# Altium project slave-18-ltc6813-1.PrjPcb (part 1 of 2)
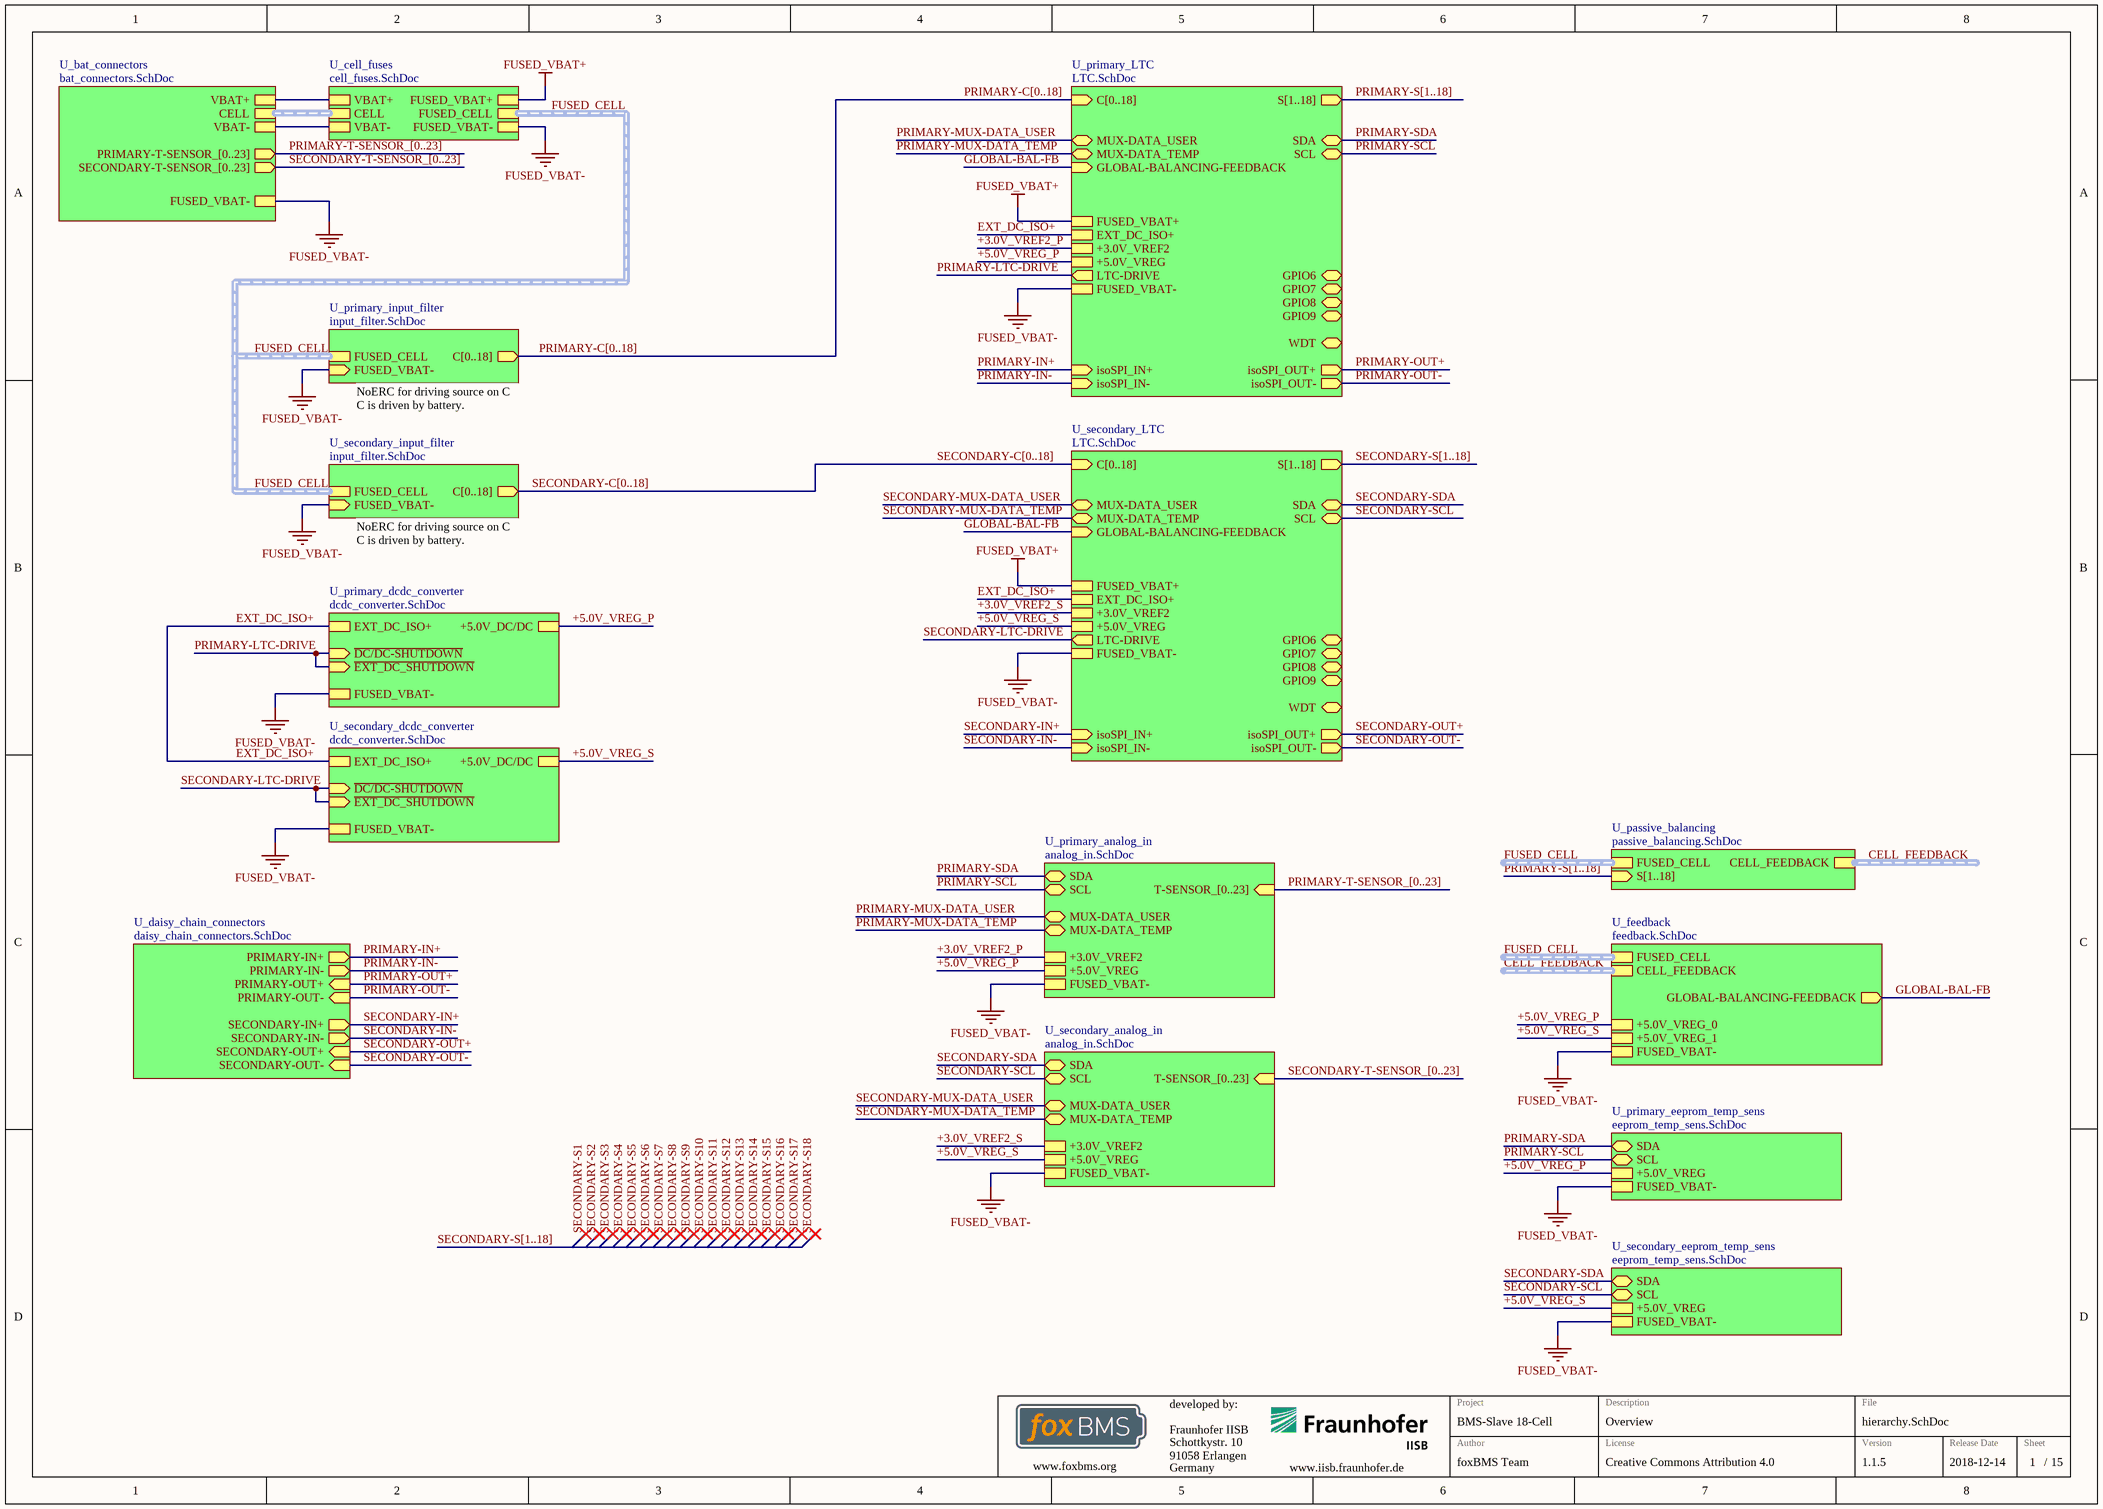
[diagram p0: hierarchy.SchDoc]
GlobalDate: 2018-12-14; GlobalLicense: Creative Commons Attribution 4.0; GlobalProject: BMS-Slave 18-Cell; GlobalVersion: 1.1.5
10 sheets, 519 parts. Net scope: strictly hierarchical (ports join the sheet entries above them; power ports are local).
Board files: slave.PcbDoc, AMS_Slave.PcbDoc
Sheets:
  hierarchy.SchDoc
    U_cell_fuses = cell_fuses.SchDoc
    U_primary_input_filter = input_filter.SchDoc
    U_secondary_input_filter = input_filter.SchDoc
    U_feedback = feedback.SchDoc
    U_primary_LTC = LTC.SchDoc
    U_secondary_eeprom_temp_sens = eeprom_temp_sens.SchDoc
    U_secondary_analog_in = analog_in.SchDoc
    U_daisy_chain_connectors = daisy_chain_connectors.SchDoc
    U_bat_connectors = bat_connectors.SchDoc
    U_primary_dcdc_converter = dcdc_converter.SchDoc
    U_secondary_dcdc_converter = dcdc_converter.SchDoc
    U_secondary_LTC = LTC.SchDoc
    U_primary_eeprom_temp_sens = eeprom_temp_sens.SchDoc
    U_primary_analog_in = analog_in.SchDoc

## Sheet hierarchy.SchDoc
size A3; DocumentNumber: 1; SheetNumber: 1; SheetTotal: 15; SheetDescription: Overview

### Sub-sheets
U_bat_connectors = bat_connectors.SchDoc: CELL (harness CELL_VOLTAGES), PRIMARY-T-SENSOR_[0..23] (out), SECONDARY-T-SENSOR_[0..23] (out), VBAT+, VBAT-, FUSED_VBAT-
U_cell_fuses = cell_fuses.SchDoc: FUSED_CELL (harness CELL_VOLTAGES), CELL (harness CELL_VOLTAGES), VBAT+, VBAT-, FUSED_VBAT+, FUSED_VBAT-
U_daisy_chain_connectors = daisy_chain_connectors.SchDoc: SECONDARY-IN+ (out), SECONDARY-IN- (out), SECONDARY-OUT+ (in), SECONDARY-OUT- (in), PRIMARY-IN+ (out), PRIMARY-IN- (out), PRIMARY-OUT- (in), PRIMARY-OUT+ (in)
U_feedback = feedback.SchDoc: GLOBAL-BALANCING-FEEDBACK (out), CELL_FEEDBACK (harness CELL_FEEDBACK), FUSED_CELL (harness CELL_VOLTAGES), +5.0V_VREG_1, +5.0V_VREG_0, FUSED_VBAT-
U_passive_balancing = passive_balancing.SchDoc (file not in this document): FUSED_CELL (harness CELL_VOLTAGES), S[1..18] (in), CELL_FEEDBACK (harness CELL_FEEDBACK)
U_primary_analog_in = analog_in.SchDoc: MUX-DATA_TEMP (bidir), MUX-DATA_USER (bidir), T-SENSOR_[0..23] (in), SCL (bidir), SDA (bidir), +5.0V_VREG, FUSED_VBAT-, +3.0V_VREF2
U_primary_dcdc_converter = dcdc_converter.SchDoc: +5.0V_DC/DC, FUSED_VBAT-, ~{DC/DC-SHUTDOWN} (in), EXT_DC_ISO+, ~{EXT_DC_SHUTDOWN} (in)
U_primary_eeprom_temp_sens = eeprom_temp_sens.SchDoc: SDA (bidir), SCL (bidir), FUSED_VBAT-, +5.0V_VREG
U_primary_input_filter = input_filter.SchDoc: FUSED_CELL (harness CELL_VOLTAGES), C[0..18] (out), FUSED_VBAT- (in)
U_primary_LTC = LTC.SchDoc: isoSPI_IN- (in), isoSPI_IN+ (in), isoSPI_OUT- (out), isoSPI_OUT+ (out), MUX-DATA_USER (bidir), SCL (bidir), MUX-DATA_TEMP (bidir), GLOBAL-BALANCING-FEEDBACK (in), SDA (bidir), EXT_DC_ISO+, C[0..18] (in), S[1..18] (out), WDT (bidir), GPIO8 (bidir), GPIO7 (bidir), GPIO9 (bidir), GPIO6 (bidir), FUSED_VBAT+, FUSED_VBAT-, +5.0V_VREG, +3.0V_VREF2, LTC-DRIVE (out)
U_secondary_analog_in = analog_in.SchDoc: MUX-DATA_TEMP (bidir), MUX-DATA_USER (bidir), T-SENSOR_[0..23] (in), SCL (bidir), SDA (bidir), +5.0V_VREG, FUSED_VBAT-, +3.0V_VREF2
U_secondary_dcdc_converter = dcdc_converter.SchDoc: +5.0V_DC/DC, FUSED_VBAT-, ~{DC/DC-SHUTDOWN} (in), EXT_DC_ISO+, ~{EXT_DC_SHUTDOWN} (in)
U_secondary_eeprom_temp_sens = eeprom_temp_sens.SchDoc: SDA (bidir), SCL (bidir), FUSED_VBAT-, +5.0V_VREG
U_secondary_input_filter = input_filter.SchDoc: FUSED_CELL (harness CELL_VOLTAGES), C[0..18] (out), FUSED_VBAT- (in)
U_secondary_LTC = LTC.SchDoc: isoSPI_IN- (in), isoSPI_IN+ (in), isoSPI_OUT- (out), isoSPI_OUT+ (out), MUX-DATA_USER (bidir), SCL (bidir), MUX-DATA_TEMP (bidir), GLOBAL-BALANCING-FEEDBACK (in), SDA (bidir), EXT_DC_ISO+, C[0..18] (in), S[1..18] (out), WDT (bidir), GPIO8 (bidir), GPIO7 (bidir), GPIO9 (bidir), GPIO6 (bidir), FUSED_VBAT+, FUSED_VBAT-, +5.0V_VREG, +3.0V_VREF2, LTC-DRIVE (out)

### Nets
+3.0V_VREF2_P: sheet U_primary_LTC/+3.0V_VREF2, sheet U_primary_analog_in/+3.0V_VREF2  [project net +3.0V_VREF2]
+3.0V_VREF2_S: sheet U_secondary_analog_in/+3.0V_VREF2, sheet U_secondary_LTC/+3.0V_VREF2  [project net +3.0V_VREF2]
+5.0V_VREG_P: sheet U_feedback/+5.0V_VREG_0, sheet U_primary_LTC/+5.0V_VREG, sheet U_primary_dcdc_converter/+5.0V_DC/DC, sheet U_primary_eeprom_temp_sens/+5.0V_VREG, sheet U_primary_analog_in/+5.0V_VREG  [project net +5.0V_VREG]
+5.0V_VREG_S: sheet U_feedback/+5.0V_VREG_1, sheet U_secondary_eeprom_temp_sens/+5.0V_VREG, sheet U_secondary_analog_in/+5.0V_VREG, sheet U_secondary_dcdc_converter/+5.0V_DC/DC, sheet U_secondary_LTC/+5.0V_VREG  [project net +5.0V_VREG]
FUSED_VBAT+: sheet U_cell_fuses/FUSED_VBAT+, sheet U_primary_LTC/FUSED_VBAT+, sheet U_secondary_LTC/FUSED_VBAT+
FUSED_VBAT-: sheet U_cell_fuses/FUSED_VBAT-, sheet U_primary_input_filter/FUSED_VBAT-, sheet U_secondary_input_filter/FUSED_VBAT-, sheet U_feedback/FUSED_VBAT-, sheet U_primary_LTC/FUSED_VBAT-, sheet U_secondary_eeprom_temp_sens/FUSED_VBAT-, sheet U_secondary_analog_in/FUSED_VBAT-, sheet U_bat_connectors/FUSED_VBAT-, sheet U_primary_dcdc_converter/FUSED_VBAT-, sheet U_secondary_dcdc_converter/FUSED_VBAT-, sheet U_secondary_LTC/FUSED_VBAT-, sheet U_primary_eeprom_temp_sens/FUSED_VBAT-, sheet U_primary_analog_in/FUSED_VBAT-
VBAT+: sheet U_cell_fuses/VBAT+, sheet U_bat_connectors/VBAT+
VBAT-: sheet U_cell_fuses/VBAT-, sheet U_bat_connectors/VBAT-
EXT_DC_ISO+: sheet U_primary_LTC/EXT_DC_ISO+, sheet U_primary_dcdc_converter/EXT_DC_ISO+, sheet U_secondary_dcdc_converter/EXT_DC_ISO+, sheet U_secondary_LTC/EXT_DC_ISO+
GLOBAL-BAL-FB: sheet U_feedback/GLOBAL-BALANCING-FEEDBACK, sheet U_primary_LTC/GLOBAL-BALANCING-FEEDBACK, sheet U_secondary_LTC/GLOBAL-BALANCING-FEEDBACK
PRIMARY-IN+: sheet U_primary_LTC/isoSPI_IN+, sheet U_daisy_chain_connectors/PRIMARY-IN+
PRIMARY-IN-: sheet U_primary_LTC/isoSPI_IN-, sheet U_daisy_chain_connectors/PRIMARY-IN-
PRIMARY-LTC-DRIVE: sheet U_primary_LTC/LTC-DRIVE, sheet U_primary_dcdc_converter/~{DC/DC-SHUTDOWN}, sheet U_primary_dcdc_converter/~{EXT_DC_SHUTDOWN}
PRIMARY-MUX-DATA_TEMP: sheet U_primary_LTC/MUX-DATA_TEMP, sheet U_primary_analog_in/MUX-DATA_TEMP
PRIMARY-MUX-DATA_USER: sheet U_primary_LTC/MUX-DATA_USER, sheet U_primary_analog_in/MUX-DATA_USER
PRIMARY-OUT+: sheet U_primary_LTC/isoSPI_OUT+, sheet U_daisy_chain_connectors/PRIMARY-OUT+
PRIMARY-OUT-: sheet U_primary_LTC/isoSPI_OUT-, sheet U_daisy_chain_connectors/PRIMARY-OUT-
PRIMARY-SCL: sheet U_primary_LTC/SCL, sheet U_primary_LTC/SDA, sheet U_primary_eeprom_temp_sens/SDA, sheet U_primary_eeprom_temp_sens/SCL, sheet U_primary_analog_in/SCL, sheet U_primary_analog_in/SDA  [also labelled PRIMARY-SDA]
SECONDARY-IN+: sheet U_daisy_chain_connectors/SECONDARY-IN+, sheet U_secondary_LTC/isoSPI_IN+
SECONDARY-IN-: sheet U_daisy_chain_connectors/SECONDARY-IN-, sheet U_secondary_LTC/isoSPI_IN-
SECONDARY-LTC-DRIVE: sheet U_secondary_dcdc_converter/~{DC/DC-SHUTDOWN}, sheet U_secondary_dcdc_converter/~{EXT_DC_SHUTDOWN}, sheet U_secondary_LTC/LTC-DRIVE
SECONDARY-MUX-DATA_TEMP: sheet U_secondary_analog_in/MUX-DATA_TEMP, sheet U_secondary_LTC/MUX-DATA_TEMP
SECONDARY-MUX-DATA_USER: sheet U_secondary_analog_in/MUX-DATA_USER, sheet U_secondary_LTC/MUX-DATA_USER
SECONDARY-OUT+: sheet U_daisy_chain_connectors/SECONDARY-OUT+, sheet U_secondary_LTC/isoSPI_OUT+
SECONDARY-OUT-: sheet U_daisy_chain_connectors/SECONDARY-OUT-, sheet U_secondary_LTC/isoSPI_OUT-
SECONDARY-SCL: sheet U_secondary_eeprom_temp_sens/SDA, sheet U_secondary_eeprom_temp_sens/SCL, sheet U_secondary_analog_in/SCL, sheet U_secondary_analog_in/SDA, sheet U_secondary_LTC/SCL, sheet U_secondary_LTC/SDA  [also labelled SECONDARY-SDA]

### Buses and harness runs
bus PRIMARY-C[0..18] = sheet U_primary_input_filter/C[0..18] = sheet U_primary_LTC/C[0..18]
bus PRIMARY-S[1..18] = sheet U_passive_balancing/S[1..18]
bus PRIMARY-S[1..18] = sheet U_primary_LTC/S[1..18]
bus PRIMARY-T-SENSOR_[0..23] = sheet U_bat_connectors/PRIMARY-T-SENSOR_[0..23]
bus PRIMARY-T-SENSOR_[0..23] = sheet U_primary_analog_in/T-SENSOR_[0..23]
bus SECONDARY-C[0..18] = sheet U_secondary_input_filter/C[0..18] = sheet U_secondary_LTC/C[0..18]
bus SECONDARY-S[1..18]
bus SECONDARY-S[1..18] = sheet U_secondary_LTC/S[1..18]
bus SECONDARY-T-SENSOR_[0..23] = sheet U_bat_connectors/SECONDARY-T-SENSOR_[0..23]
bus SECONDARY-T-SENSOR_[0..23] = sheet U_secondary_analog_in/T-SENSOR_[0..23]
harness CELL_FEEDBACK = sheet U_feedback/CELL_FEEDBACK
harness CELL_FEEDBACK = sheet U_passive_balancing/CELL_FEEDBACK
harness FUSED_CELL = sheet U_cell_fuses/FUSED_CELL = sheet U_primary_input_filter/FUSED_CELL = sheet U_secondary_input_filter/FUSED_CELL
harness FUSED_CELL = sheet U_feedback/FUSED_CELL
harness FUSED_CELL = sheet U_passive_balancing/FUSED_CELL
harness sheet U_bat_connectors/CELL = sheet U_cell_fuses/CELL

### Notes on the sheet
- NoERC for driving source on C
  C is driven by battery.
- Labels drawn without touching a wire or pin: SECONDARY-S1, SECONDARY-S2, SECONDARY-S3, SECONDARY-S4, SECONDARY-S5, SECONDARY-S6, SECONDARY-S7, SECONDARY-S8, SECONDARY-S9, SECONDARY-S10, SECONDARY-S11, SECONDARY-S12, SECONDARY-S13, SECONDARY-S14, SECONDARY-S15, SECONDARY-S16, SECONDARY-S17, SECONDARY-S18
- Fraunhofer IISB
- Schottkystr. 10
- developed by:
- 91058 Erlangen
- Germany
- Author
- Project
- License
- Description
- File
- Version
- Release Date
- Sheet
- www.foxbms.org
- www.iisb.fraunhofer.de
- foxBMS Team
- /

## Sheet cell_fuses.SchDoc: foxBMS BMS-Slave 12-Cell
size A3; DocumentNumber: 3; SheetNumber: 3; SheetTotal: 15; AUTHOR: Fraunhofer IISB foxBMS Team; SheetDescription: Cell Voltage Sense Fuses
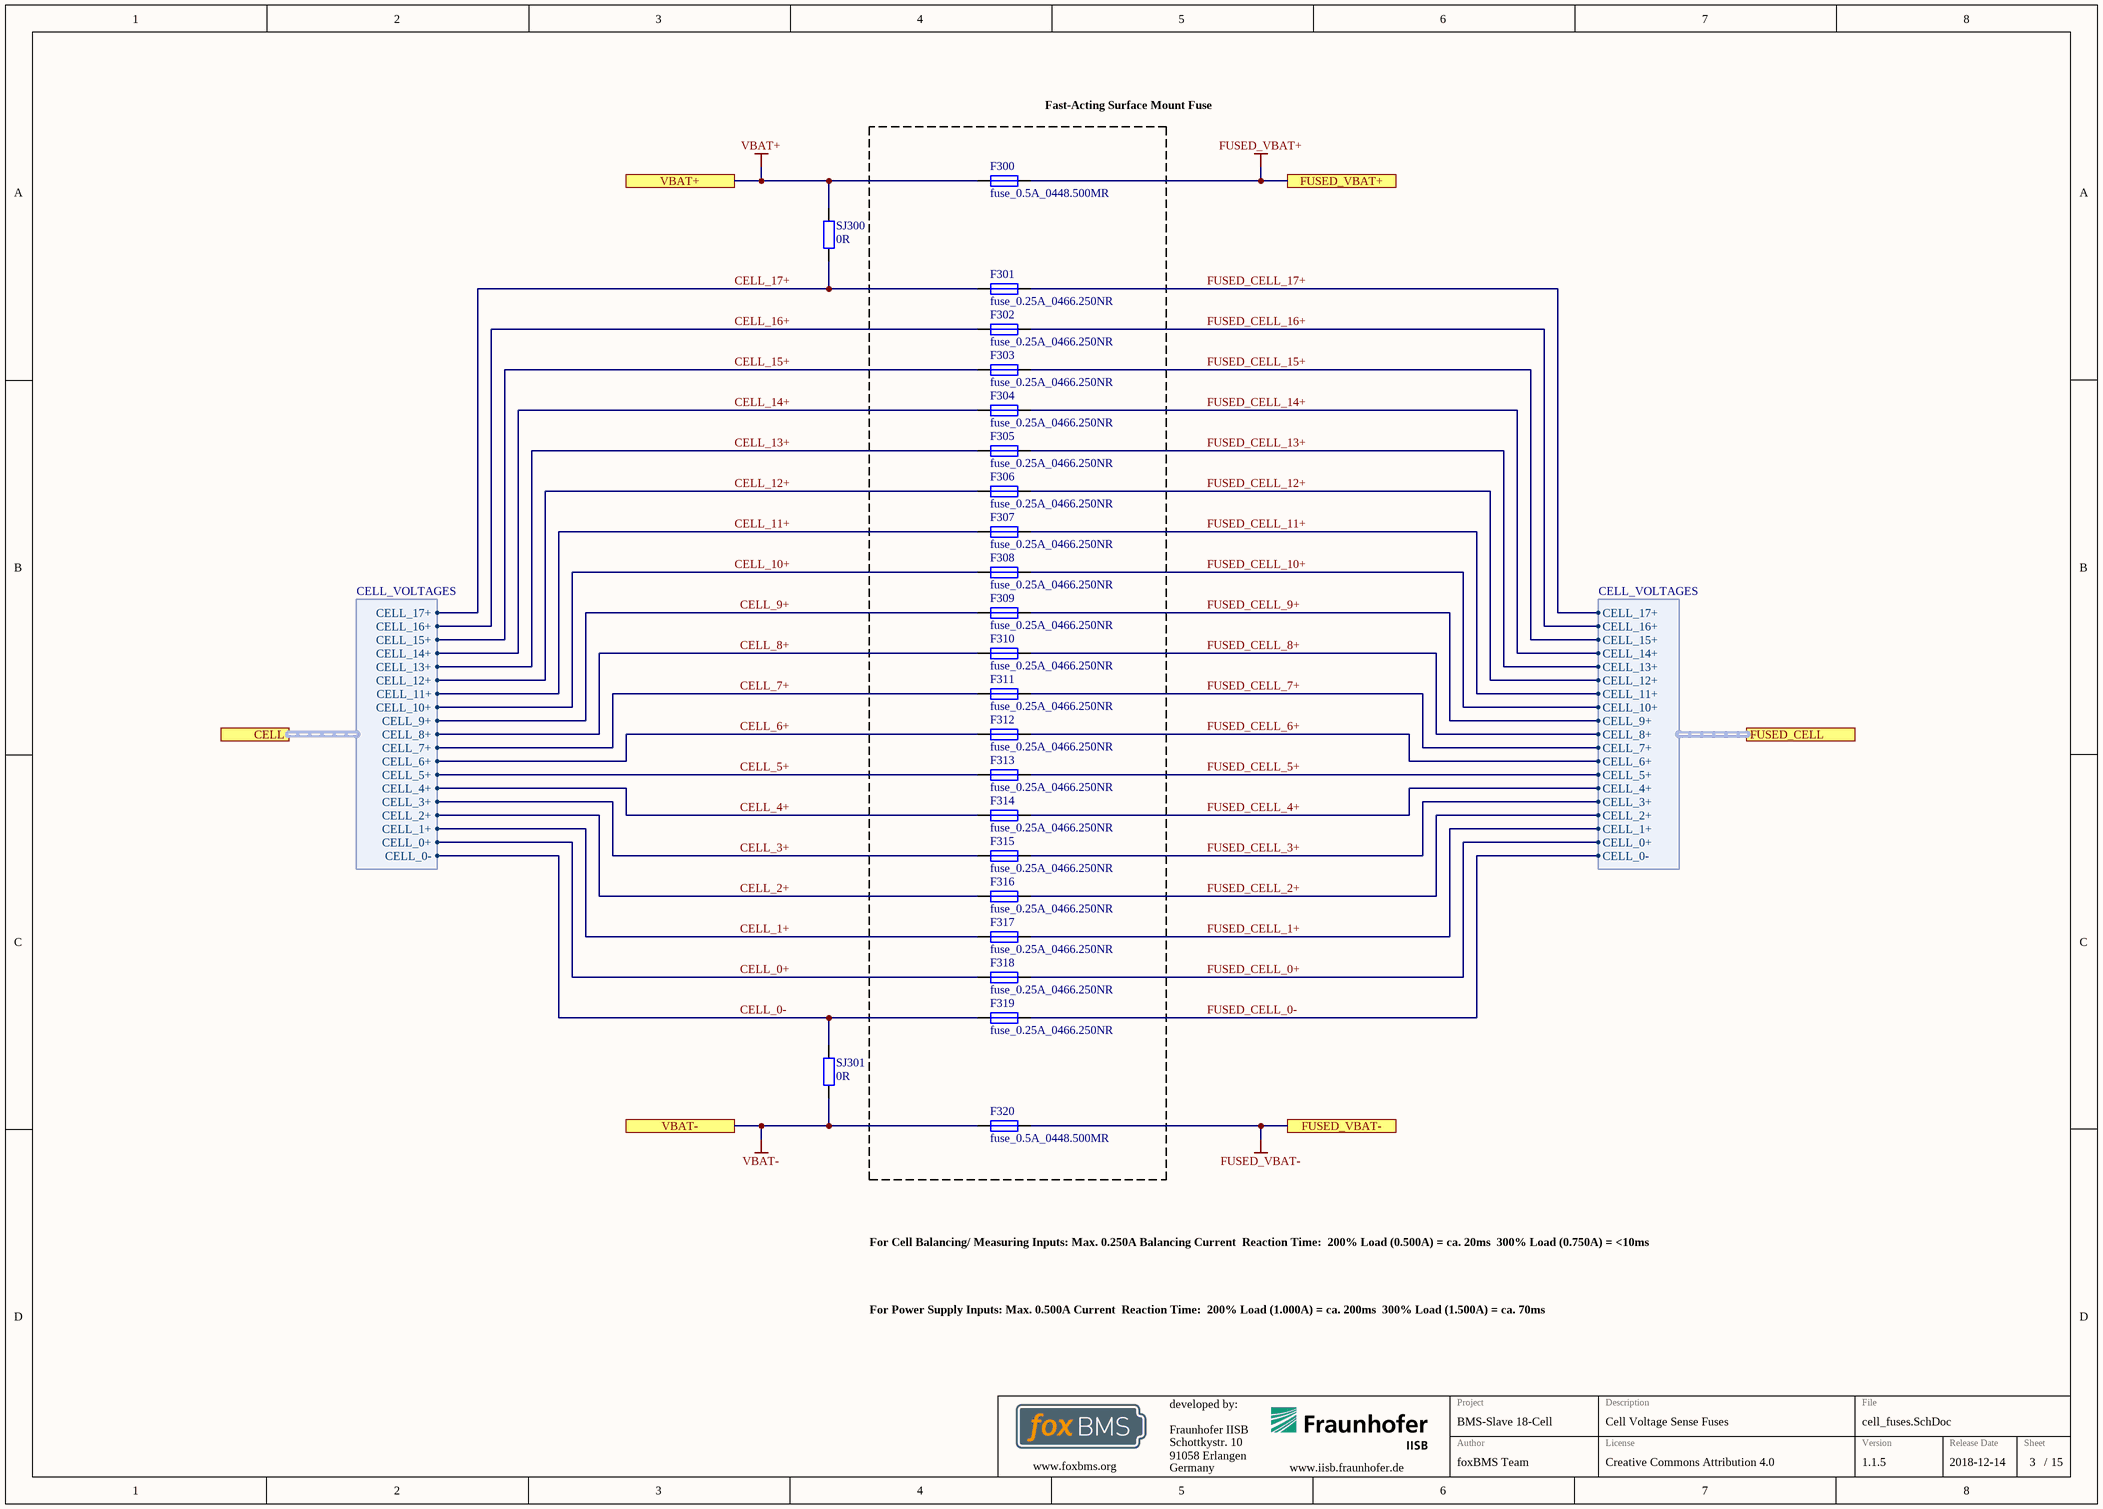
[diagram p1: cell_fuses.SchDoc]

### Parts
F300  fuse_0.5A_0448.500MR  [LITTLEFUSE_448]
F301  fuse_0.25A_0466.250NR  [LITTLEFUSE_466]
F302  fuse_0.25A_0466.250NR  [LITTLEFUSE_466]
F303  fuse_0.25A_0466.250NR  [LITTLEFUSE_466]
F304  fuse_0.25A_0466.250NR  [LITTLEFUSE_466]
F305  fuse_0.25A_0466.250NR  [LITTLEFUSE_466]
F306  fuse_0.25A_0466.250NR  [LITTLEFUSE_466]
F307  fuse_0.25A_0466.250NR  [LITTLEFUSE_466]
F308  fuse_0.25A_0466.250NR  [LITTLEFUSE_466]
F309  fuse_0.25A_0466.250NR  [LITTLEFUSE_466]
F310  fuse_0.25A_0466.250NR  [LITTLEFUSE_466]
F311  fuse_0.25A_0466.250NR  [LITTLEFUSE_466]
F312  fuse_0.25A_0466.250NR  [LITTLEFUSE_466]
F313  fuse_0.25A_0466.250NR  [LITTLEFUSE_466]
F314  fuse_0.25A_0466.250NR  [LITTLEFUSE_466]
F315  fuse_0.25A_0466.250NR  [LITTLEFUSE_466]
F316  fuse_0.25A_0466.250NR  [LITTLEFUSE_466]
F317  fuse_0.25A_0466.250NR  [LITTLEFUSE_466]
F318  fuse_0.25A_0466.250NR  [LITTLEFUSE_466]
F319  fuse_0.25A_0466.250NR  [LITTLEFUSE_466]
F320  fuse_0.5A_0448.500MR  [LITTLEFUSE_448]
SJ300  0R  [RESC1608X05N]
SJ301  0R  [RESC1608X05N]

### Blocks framed on the sheet
Fast-Acting Surface Mount Fuse: F300-F320

### Ports
CELL (harness CELL_VOLTAGES), FUSED_CELL (harness CELL_VOLTAGES), FUSED_VBAT+, FUSED_VBAT-, VBAT+, VBAT-

### Harnesses
CELL_VOLTAGES: CELL_0-, CELL_0+, CELL_1+, CELL_10+, CELL_11+, CELL_12+, CELL_13+, CELL_14+, CELL_15+, CELL_16+, CELL_17+, CELL_2+, CELL_3+, CELL_4+, CELL_5+, CELL_6+, CELL_7+, CELL_8+, CELL_9+

### Nets
FUSED_VBAT+: F300.2 ; port FUSED_VBAT+
FUSED_VBAT-: F320.2 ; port FUSED_VBAT-
VBAT+: F300.1 SJ300.1 ; port VBAT+
VBAT-: F320.1 SJ301.2 ; port VBAT-
CELL_0+: F318.1 ; port CELL.CELL_0+
CELL_0-: F319.1 SJ301.1 ; port CELL.CELL_0-
CELL_1+: F317.1 ; port CELL.CELL_1+
CELL_2+: F316.1 ; port CELL.CELL_2+
CELL_3+: F315.1 ; port CELL.CELL_3+
CELL_4+: F314.1 ; port CELL.CELL_4+
CELL_5+: F313.1 ; port CELL.CELL_5+
CELL_6+: F312.1 ; port CELL.CELL_6+
CELL_7+: F311.1 ; port CELL.CELL_7+
CELL_8+: F310.1 ; port CELL.CELL_8+
CELL_9+: F309.1 ; port CELL.CELL_9+
CELL_10+: F308.1 ; port CELL.CELL_10+
CELL_11+: F307.1 ; port CELL.CELL_11+
CELL_12+: F306.1 ; port CELL.CELL_12+
CELL_13+: F305.1 ; port CELL.CELL_13+
CELL_14+: F304.1 ; port CELL.CELL_14+
CELL_15+: F303.1 ; port CELL.CELL_15+
CELL_16+: F302.1 ; port CELL.CELL_16+
CELL_17+: F301.1 SJ300.2 ; port CELL.CELL_17+
FUSED_CELL_0+: F318.2 ; port FUSED_CELL.CELL_0+  [project net FUSED_CELL.CELL_0+]
FUSED_CELL_0-: F319.2 ; port FUSED_CELL.CELL_0-  [project net FUSED_CELL.CELL_0-]
FUSED_CELL_1+: F317.2 ; port FUSED_CELL.CELL_1+  [project net FUSED_CELL.CELL_1+]
FUSED_CELL_2+: F316.2 ; port FUSED_CELL.CELL_2+  [project net FUSED_CELL.CELL_2+]
FUSED_CELL_3+: F315.2 ; port FUSED_CELL.CELL_3+  [project net FUSED_CELL.CELL_3+]
FUSED_CELL_4+: F314.2 ; port FUSED_CELL.CELL_4+  [project net FUSED_CELL.CELL_4+]
FUSED_CELL_5+: F313.2 ; port FUSED_CELL.CELL_5+  [project net FUSED_CELL.CELL_5+]
FUSED_CELL_6+: F312.2 ; port FUSED_CELL.CELL_6+  [project net FUSED_CELL.CELL_6+]
FUSED_CELL_7+: F311.2 ; port FUSED_CELL.CELL_7+  [project net FUSED_CELL.CELL_7+]
FUSED_CELL_8+: F310.2 ; port FUSED_CELL.CELL_8+  [project net FUSED_CELL.CELL_8+]
FUSED_CELL_9+: F309.2 ; port FUSED_CELL.CELL_9+  [project net FUSED_CELL.CELL_9+]
FUSED_CELL_10+: F308.2 ; port FUSED_CELL.CELL_10+  [project net FUSED_CELL.CELL_10+]
FUSED_CELL_11+: F307.2 ; port FUSED_CELL.CELL_11+  [project net FUSED_CELL.CELL_11+]
FUSED_CELL_12+: F306.2 ; port FUSED_CELL.CELL_12+  [project net FUSED_CELL.CELL_12+]
FUSED_CELL_13+: F305.2 ; port FUSED_CELL.CELL_13+  [project net FUSED_CELL.CELL_13+]
FUSED_CELL_14+: F304.2 ; port FUSED_CELL.CELL_14+  [project net FUSED_CELL.CELL_14+]
FUSED_CELL_15+: F303.2 ; port FUSED_CELL.CELL_15+  [project net FUSED_CELL.CELL_15+]
FUSED_CELL_16+: F302.2 ; port FUSED_CELL.CELL_16+  [project net FUSED_CELL.CELL_16+]
FUSED_CELL_17+: F301.2 ; port FUSED_CELL.CELL_17+  [project net FUSED_CELL.CELL_17+]

### Notes on the sheet
- For Cell Balancing/ Measuring Inputs: Max. 0.250A Balancing Current
  Reaction Time:
  200% Load (0.500A) = ca. 20ms
  300% Load (0.750A) = <10ms
- For Power Supply Inputs: Max. 0.500A Current
  Reaction Time:
  200% Load (1.000A) = ca. 200ms
  300% Load (1.500A) = ca. 70ms
- Fraunhofer IISB
- Schottkystr. 10
- developed by:
- 91058 Erlangen
- Germany
- Author
- Project
- License
- Description
- File
- Version
- Release Date
- Sheet
- www.foxbms.org
- www.iisb.fraunhofer.de
- foxBMS Team
- /

### Library data of the parts
F300 F320 = fuse_0.5A_0448.500MR: Fuse, Surface Mount, NANO2 Series, 500 mA, 125 VAC, 32 VDC, Very Fast Acting, SMD; Manufacturer: Littlefuse; Automotive Qualified: False; Part Number: fuse_0.5A_0448.500MR; Operating Temperature: -55°C - +125°C; ComponentLink1Description: Datasheet; ComponentLink1URL: http://www.farnell.com/datasheets/1792947.pdf; Supplier 1: Farnell; Supplier Part Number 1: 1596919
F301-F319 = fuse_0.25A_0466.250NR: Fuse, Surface Mount, 466 Series, 250 mA, 125 VAC, 125 VDC, Very Fast Acting, 1206; Manufacturer: Littlefuse; Automotive Qualified: False; Part Number: fuse_0.25A_0466.250NR; Operating Temperature: -55°C - +90°C; ComponentLink1Description: Datasheet; ComponentLink1URL: http://www.farnell.com/datasheets/1796765.pdf; Supplier 1: Farnell; Supplier Part Number 1: 9921826
SJ300 SJ301 = gen_R_0R_0603: SMD Resistor 0R 0603; Power: 0.1W; Case EIA: 0603; Case Metric: 1608; Maximum Working Voltage: 75V; PnP Package: R_0603; Automotive Qualified: True; Part Number: gen_R_0R_0603; Operating Temperature: -55°C - +155°C; Resistance: 0R; Series: Jumper; PnP Value: 0R; Supplier 1: Farnell; Supplier Part Number 1: 2616580

## Sheet input_filter.SchDoc: foxBMS BMS-Slave 12-Cell
size A3; DocumentNumber: 4; SheetNumber: 4; SheetTotal: 15; AUTHOR: Fraunhofer IISB foxBMS Team; SheetDescription: Primary Voltage Measurement
Used 2 times, as channels U_primary_input_filter, U_secondary_input_filter. Parts and nets are listed once, with the designators drawn on the sheet.
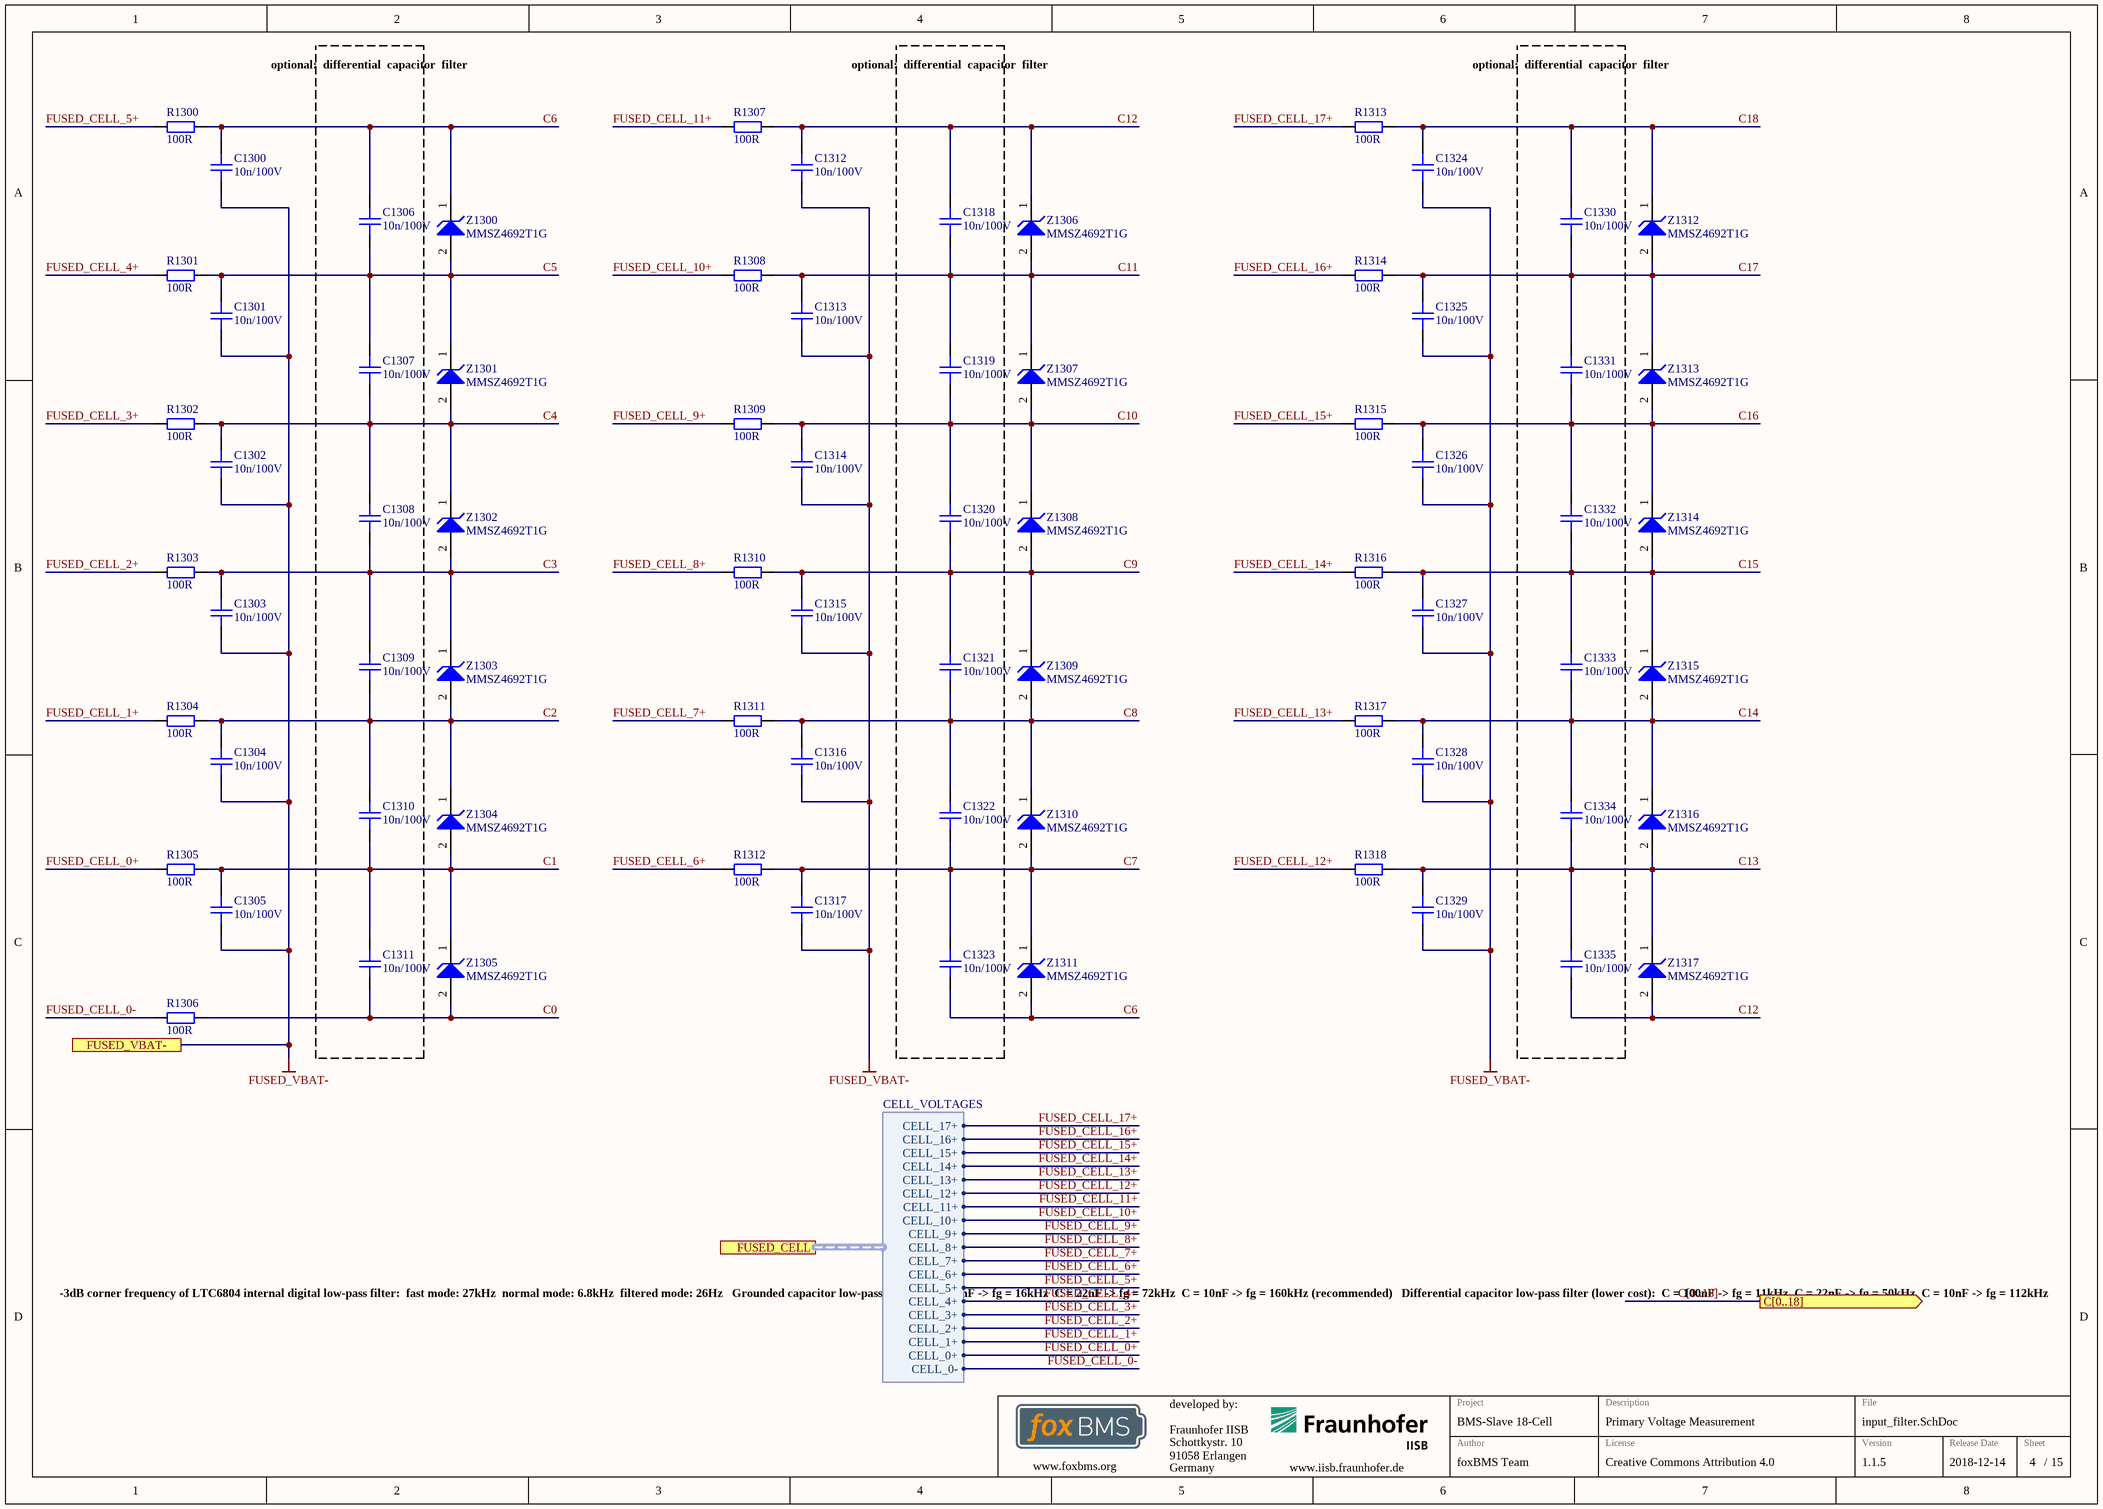
[diagram p2: input_filter.SchDoc]

### Parts
C1300  10n/100V  [CAPC1608X08N]
C1301  10n/100V  [CAPC1608X08N]
C1302  10n/100V  [CAPC1608X08N]
C1303  10n/100V  [CAPC1608X08N]
C1304  10n/100V  [CAPC1608X08N]
C1305  10n/100V  [CAPC1608X08N]
C1306  10n/100V  [CAPC1608X08N]
C1307  10n/100V  [CAPC1608X08N]
C1308  10n/100V  [CAPC1608X08N]
C1309  10n/100V  [CAPC1608X08N]
C1310  10n/100V  [CAPC1608X08N]
C1311  10n/100V  [CAPC1608X08N]
C1312  10n/100V  [CAPC1608X08N]
C1313  10n/100V  [CAPC1608X08N]
C1314  10n/100V  [CAPC1608X08N]
C1315  10n/100V  [CAPC1608X08N]
C1316  10n/100V  [CAPC1608X08N]
C1317  10n/100V  [CAPC1608X08N]
C1318  10n/100V  [CAPC1608X08N]
C1319  10n/100V  [CAPC1608X08N]
C1320  10n/100V  [CAPC1608X08N]
C1321  10n/100V  [CAPC1608X08N]
C1322  10n/100V  [CAPC1608X08N]
C1323  10n/100V  [CAPC1608X08N]
C1324  10n/100V  [CAPC1608X08N]
C1325  10n/100V  [CAPC1608X08N]
C1326  10n/100V  [CAPC1608X08N]
C1327  10n/100V  [CAPC1608X08N]
C1328  10n/100V  [CAPC1608X08N]
C1329  10n/100V  [CAPC1608X08N]
C1330  10n/100V  [CAPC1608X08N]
C1331  10n/100V  [CAPC1608X08N]
C1332  10n/100V  [CAPC1608X08N]
C1333  10n/100V  [CAPC1608X08N]
C1334  10n/100V  [CAPC1608X08N]
C1335  10n/100V  [CAPC1608X08N]
R1300  100R  [RESC1608X05N]
R1301  100R  [RESC1608X05N]
R1302  100R  [RESC1608X05N]
R1303  100R  [RESC1608X05N]
R1304  100R  [RESC1608X05N]
R1305  100R  [RESC1608X05N]
R1306  100R  [RESC1608X05N]
R1307  100R  [RESC1608X05N]
R1308  100R  [RESC1608X05N]
R1309  100R  [RESC1608X05N]
R1310  100R  [RESC1608X05N]
R1311  100R  [RESC1608X05N]
R1312  100R  [RESC1608X05N]
R1313  100R  [RESC1608X05N]
R1314  100R  [RESC1608X05N]
R1315  100R  [RESC1608X05N]
R1316  100R  [RESC1608X05N]
R1317  100R  [RESC1608X05N]
R1318  100R  [RESC1608X05N]
Z1300  MMSZ4692T1G  [ONSC-SOD-123-2-425-04_V]
Z1301  MMSZ4692T1G  [ONSC-SOD-123-2-425-04_V]
Z1302  MMSZ4692T1G  [ONSC-SOD-123-2-425-04_V]
Z1303  MMSZ4692T1G  [ONSC-SOD-123-2-425-04_V]
Z1304  MMSZ4692T1G  [ONSC-SOD-123-2-425-04_V]
Z1305  MMSZ4692T1G  [ONSC-SOD-123-2-425-04_V]
Z1306  MMSZ4692T1G  [ONSC-SOD-123-2-425-04_V]
Z1307  MMSZ4692T1G  [ONSC-SOD-123-2-425-04_V]
Z1308  MMSZ4692T1G  [ONSC-SOD-123-2-425-04_V]
Z1309  MMSZ4692T1G  [ONSC-SOD-123-2-425-04_V]
Z1310  MMSZ4692T1G  [ONSC-SOD-123-2-425-04_V]
Z1311  MMSZ4692T1G  [ONSC-SOD-123-2-425-04_V]
Z1312  MMSZ4692T1G  [ONSC-SOD-123-2-425-04_V]
Z1313  MMSZ4692T1G  [ONSC-SOD-123-2-425-04_V]
Z1314  MMSZ4692T1G  [ONSC-SOD-123-2-425-04_V]
Z1315  MMSZ4692T1G  [ONSC-SOD-123-2-425-04_V]
Z1316  MMSZ4692T1G  [ONSC-SOD-123-2-425-04_V]
Z1317  MMSZ4692T1G  [ONSC-SOD-123-2-425-04_V]

### Blocks framed on the sheet
optional: / differential / capacitor / filter: C1306-C1311
optional: / differential / capacitor / filter: C1318-C1323
optional: / differential / capacitor / filter: C1330-C1335

### Ports
C[0..18] (out), FUSED_CELL (harness CELL_VOLTAGES), FUSED_VBAT-

### Harnesses
CELL_VOLTAGES: CELL_0-, CELL_0+, CELL_1+, CELL_10+, CELL_11+, CELL_12+, CELL_13+, CELL_14+, CELL_15+, CELL_16+, CELL_17+, CELL_2+, CELL_3+, CELL_4+, CELL_5+, CELL_6+, CELL_7+, CELL_8+, CELL_9+

### Nets
FUSED_VBAT-: C1300.2 C1301.2 C1302.2 C1303.2 C1304.2 C1305.2 C1312.2 C1313.2 C1314.2 C1315.2 C1316.2 C1317.2 C1324.2 C1325.2 C1326.2 C1327.2 C1328.2 C1329.2 ; port FUSED_VBAT-
C0: C1311.2 R1306.2 Z1305.2(A)
C1: C1305.1 C1310.2 C1311.1 R1305.2 Z1304.2(A) Z1305.1(K)
C2: C1304.1 C1309.2 C1310.1 R1304.2 Z1303.2(A) Z1304.1(K)
C3: C1303.1 C1308.2 C1309.1 R1303.2 Z1302.2(A) Z1303.1(K)
C4: C1302.1 C1307.2 C1308.1 R1302.2 Z1301.2(A) Z1302.1(K)
C5: C1301.1 C1306.2 C1307.1 R1301.2 Z1300.2(A) Z1301.1(K)
C6: C1300.1 C1306.1 C1323.2 R1300.2 Z1300.1(K) Z1311.2(A)
C7: C1317.1 C1322.2 C1323.1 R1312.2 Z1310.2(A) Z1311.1(K)
C8: C1316.1 C1321.2 C1322.1 R1311.2 Z1309.2(A) Z1310.1(K)
C9: C1315.1 C1320.2 C1321.1 R1310.2 Z1308.2(A) Z1309.1(K)
C10: C1314.1 C1319.2 C1320.1 R1309.2 Z1307.2(A) Z1308.1(K)
C11: C1313.1 C1318.2 C1319.1 R1308.2 Z1306.2(A) Z1307.1(K)
C12: C1312.1 C1318.1 C1335.2 R1307.2 Z1306.1(K) Z1317.2(A)
C13: C1329.1 C1334.2 C1335.1 R1318.2 Z1316.2(A) Z1317.1(K)
C14: C1328.1 C1333.2 C1334.1 R1317.2 Z1315.2(A) Z1316.1(K)
C15: C1327.1 C1332.2 C1333.1 R1316.2 Z1314.2(A) Z1315.1(K)
C16: C1326.1 C1331.2 C1332.1 R1315.2 Z1313.2(A) Z1314.1(K)
C17: C1325.1 C1330.2 C1331.1 R1314.2 Z1312.2(A) Z1313.1(K)
C18: C1324.1 C1330.1 R1313.2 Z1312.1(K)
FUSED_CELL_0+: R1305.1 ; port FUSED_CELL.CELL_0+
FUSED_CELL_0-: R1306.1 ; port FUSED_CELL.CELL_0-
FUSED_CELL_1+: R1304.1 ; port FUSED_CELL.CELL_1+
FUSED_CELL_2+: R1303.1 ; port FUSED_CELL.CELL_2+
FUSED_CELL_3+: R1302.1 ; port FUSED_CELL.CELL_3+
FUSED_CELL_4+: R1301.1 ; port FUSED_CELL.CELL_4+
FUSED_CELL_5+: R1300.1 ; port FUSED_CELL.CELL_5+
FUSED_CELL_6+: R1312.1 ; port FUSED_CELL.CELL_6+
FUSED_CELL_7+: R1311.1 ; port FUSED_CELL.CELL_7+
FUSED_CELL_8+: R1310.1 ; port FUSED_CELL.CELL_8+
FUSED_CELL_9+: R1309.1 ; port FUSED_CELL.CELL_9+
FUSED_CELL_10+: R1308.1 ; port FUSED_CELL.CELL_10+
FUSED_CELL_11+: R1307.1 ; port FUSED_CELL.CELL_11+
FUSED_CELL_12+: R1318.1 ; port FUSED_CELL.CELL_12+
FUSED_CELL_13+: R1317.1 ; port FUSED_CELL.CELL_13+
FUSED_CELL_14+: R1316.1 ; port FUSED_CELL.CELL_14+
FUSED_CELL_15+: R1315.1 ; port FUSED_CELL.CELL_15+
FUSED_CELL_16+: R1314.1 ; port FUSED_CELL.CELL_16+
FUSED_CELL_17+: R1313.1 ; port FUSED_CELL.CELL_17+

### Channels
U_primary_input_filter: designators end in _1; ports FUSED_VBAT-=FUSED_VBAT-
U_secondary_input_filter: designators end in _2; ports FUSED_VBAT-=FUSED_VBAT-

### Buses and harness runs
bus C[0..18] = port C[0..18]

### Notes on the sheet
- -3dB corner frequency of LTC6804 internal digital low-pass filter:
  fast mode: 27kHz
  normal mode: 6.8kHz
  filtered mode: 26Hz
  Grounded capacitor low-pass filter:
  C = 100nF -> fg = 16kHz
  C = 22nF -> fg = 72kHz
  C = 10nF -> fg = 160kHz (recommended)
  Differential capacitor low-pass filter (lower cost):
  C = 100nF -> fg = 11kHz
  C = 22nF -> fg = 50kHz
  C = 10nF -> fg = 112kHz
- Fraunhofer IISB
- Schottkystr. 10
- developed by:
- 91058 Erlangen
- Germany
- Author
- Project
- License
- Description
- File
- Version
- Release Date
- Sheet
- www.foxbms.org
- www.iisb.fraunhofer.de
- foxBMS Team
- /

### Library data of the parts
C1300-C1335 = gen_C_ceramic_10n_100V_X7R_0603: MLCC; Capacitance: 10n; Rated Voltage: 100V; Dielectric: X7R; Case EIA: 0603; Case Metric: 1608; Automotive Qualified: True; Part Number: gen_C_ceramic_10n_100V_X7R_0603; Supplier 1: Farnell; Supplier Part Number 1: 1301715; Supplier 2: Farnell; Supplier Part Number 2: 2821192; Supplier 3: Farnell; Supplier Part Number 3: 2210878
R1300-R1318 = gen_R_100R_0603: SMD Resistor 100R 0603; Tolerance: 1%; Power: 0.1W; Case EIA: 0603; Case Metric: 1608; Maximum Working Voltage: 75V; PnP Package: R_0603; Automotive Qualified: True; Part Number: gen_R_100R_0603; Operating Temperature: -55°C - +155°C; Resistance: 100R; Series: E24, E96; PnP Value: 100R; Supplier 1: Farnell; Supplier Part Number 1: 2303059
Z1300-Z1317 = CMP-1060-00434-1: Zener Voltage Regulator, 500 mW, 2-Pin SOD-123, Pb-Free, Tape and Reel; Manufacturer: On Semiconductor; VZ Typ (V): 6.8; P Max (W): 0.5; ComponentLink2URL: http://www.onsemi.com/pub_link/Collateral/MMSZ4678T1-D.PDF; Mounting Technology: Surface Mount; DatasheetVersion: Rev. 9; ComponentLink1Description: Manufacturer URL; ComponentLink3URL: http://www.onsemi.com/pub_link/Collateral/425-04.PDF; PackageReference: SOD-123-2-425-04; ComponentLink2Description: Datasheet; RoHS: Pb-Free; Packing: Tape and Reel; ComponentLink1URL: http://www.onsemi.com/; PackageDescription: 2-Pin SOD, Body 1.6 x 2.69 mm; ComponentLink3Description: Package Specification; PartNumber: MMSZ4692T1G; PackageVersion: Rev. G, 10/2009

## Sheet feedback.SchDoc: foxBMS BMS-Slave 12-Cell
size A3; DocumentNumber: 6; SheetNumber: 6; SheetTotal: 15; AUTHOR: Fraunhofer IISB foxBMS Team; SheetDescription: Passive Balancing Feedback
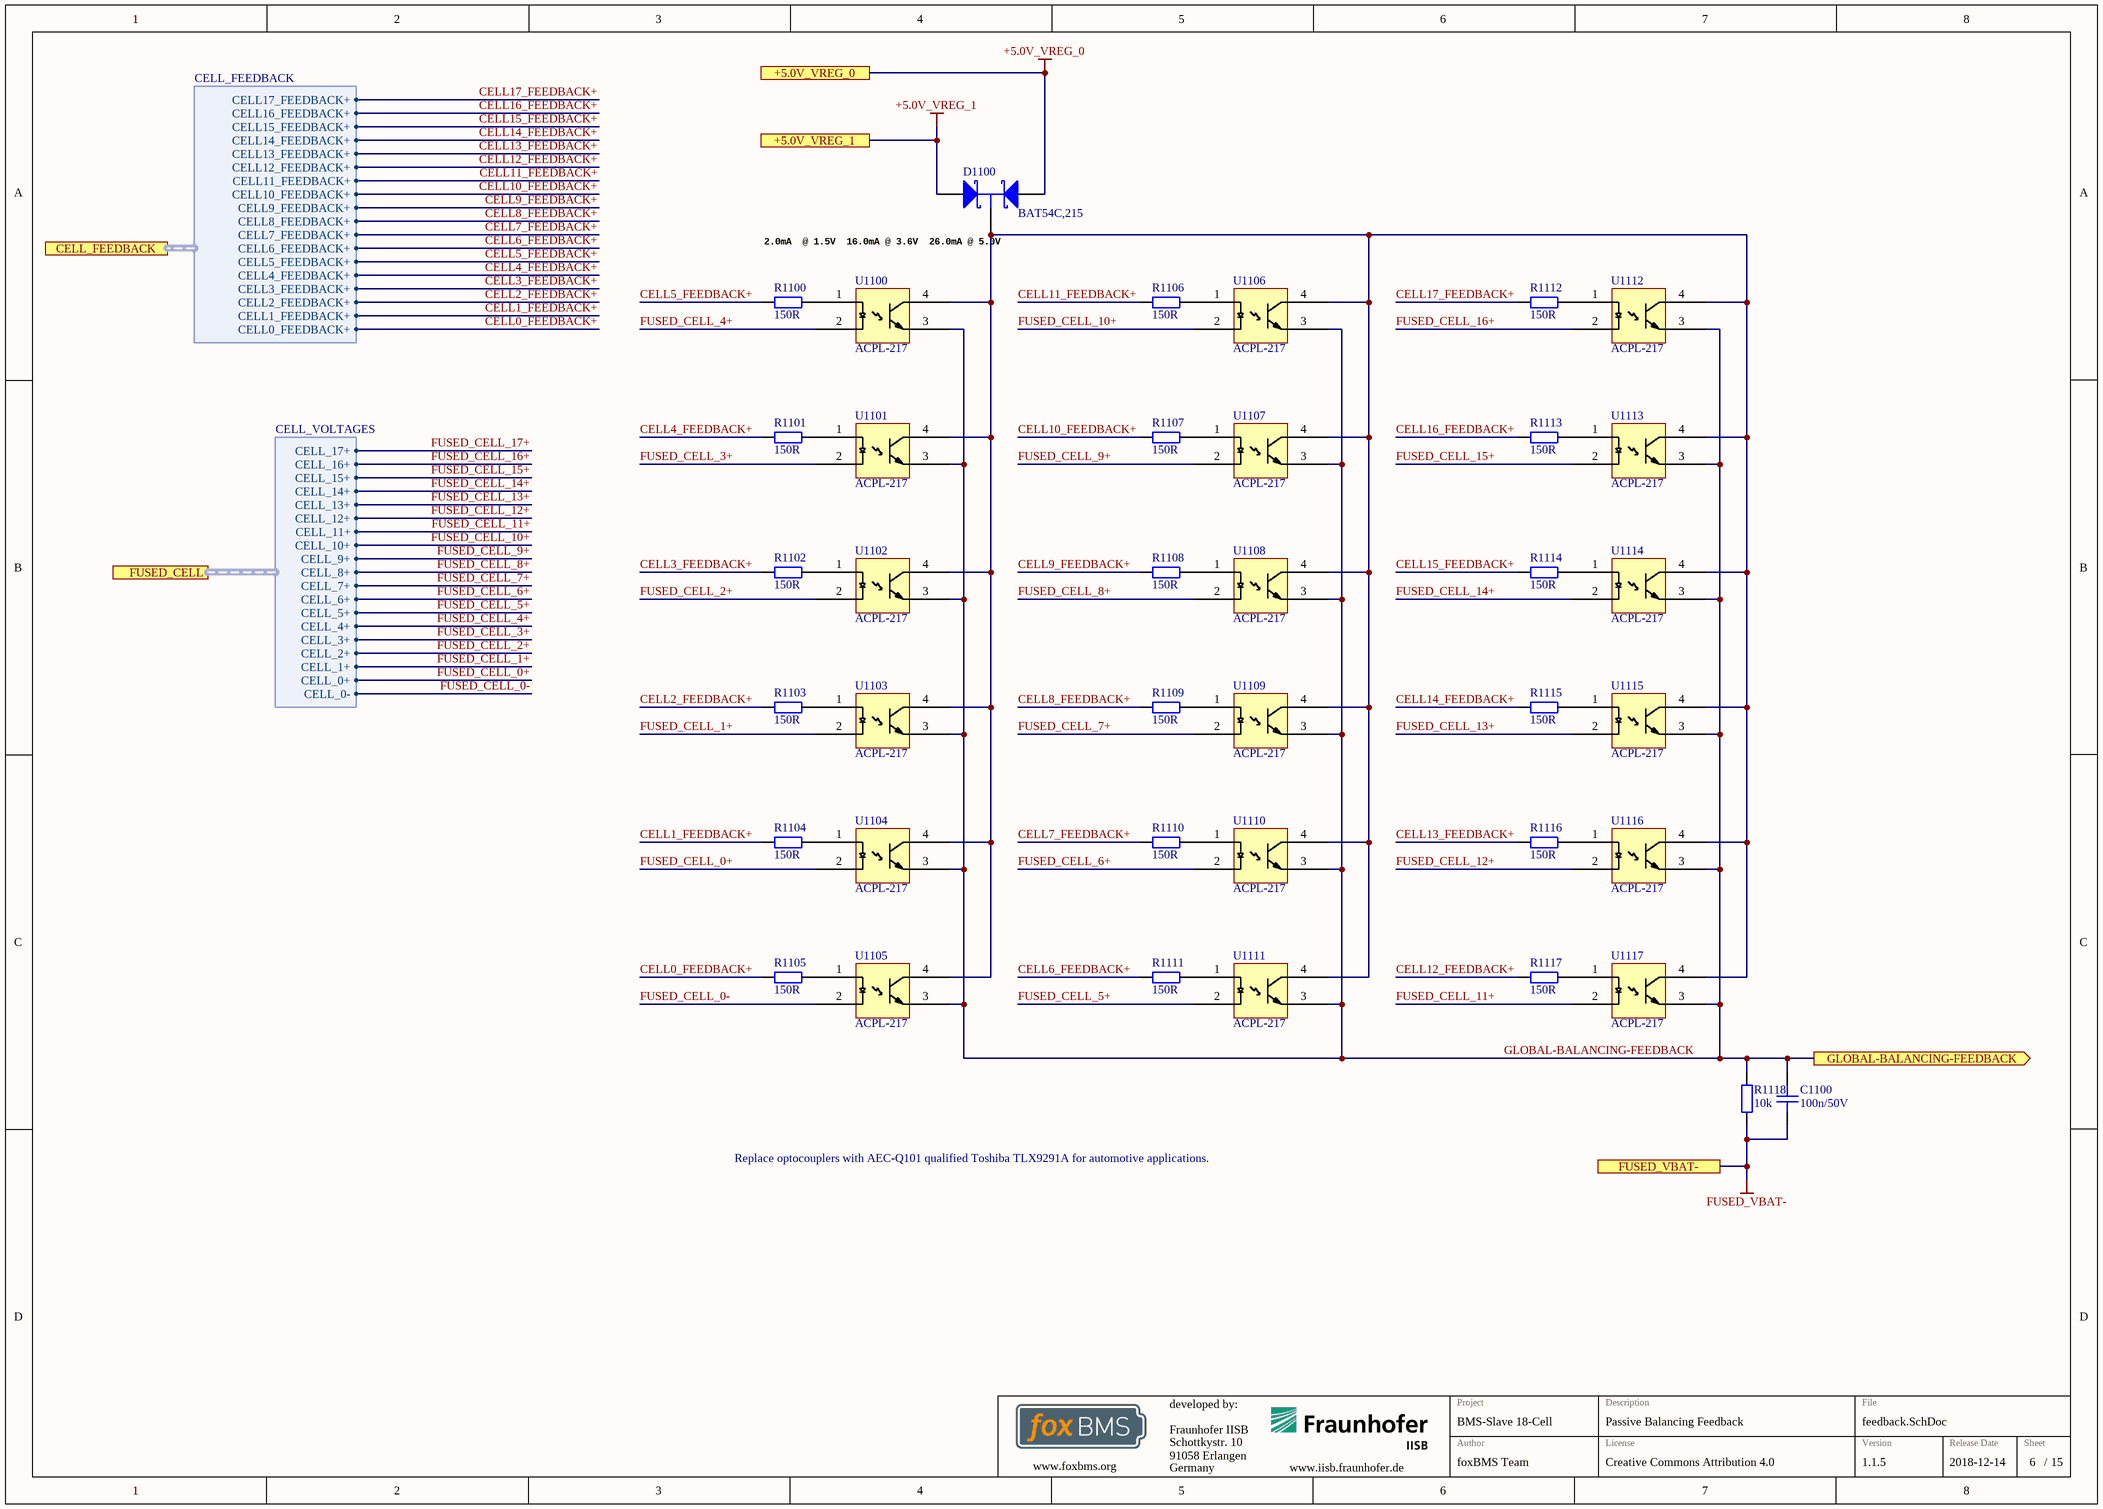
[diagram p3: feedback.SchDoc]

### Parts
C1100  100n/50V  [CAPC1608X08N]
D1100  BAT54C,215  [NXP-SOT23-3_V]
R1100  150R  [RESC1608X05N]
R1101  150R  [RESC1608X05N]
R1102  150R  [RESC1608X05N]
R1103  150R  [RESC1608X05N]
R1104  150R  [RESC1608X05N]
R1105  150R  [RESC1608X05N]
R1106  150R  [RESC1608X05N]
R1107  150R  [RESC1608X05N]
R1108  150R  [RESC1608X05N]
R1109  150R  [RESC1608X05N]
R1110  150R  [RESC1608X05N]
R1111  150R  [RESC1608X05N]
R1112  150R  [RESC1608X05N]
R1113  150R  [RESC1608X05N]
R1114  150R  [RESC1608X05N]
R1115  150R  [RESC1608X05N]
R1116  150R  [RESC1608X05N]
R1117  150R  [RESC1608X05N]
R1118  10k  [RESC1608X05N]
U1100  ACPL-217  [SOIC127P700X220-4N]
U1101  ACPL-217  [SOIC127P700X220-4N]
U1102  ACPL-217  [SOIC127P700X220-4N]
U1103  ACPL-217  [SOIC127P700X220-4N]
U1104  ACPL-217  [SOIC127P700X220-4N]
U1105  ACPL-217  [SOIC127P700X220-4N]
U1106  ACPL-217  [SOIC127P700X220-4N]
U1107  ACPL-217  [SOIC127P700X220-4N]
U1108  ACPL-217  [SOIC127P700X220-4N]
U1109  ACPL-217  [SOIC127P700X220-4N]
U1110  ACPL-217  [SOIC127P700X220-4N]
U1111  ACPL-217  [SOIC127P700X220-4N]
U1112  ACPL-217  [SOIC127P700X220-4N]
U1113  ACPL-217  [SOIC127P700X220-4N]
U1114  ACPL-217  [SOIC127P700X220-4N]
U1115  ACPL-217  [SOIC127P700X220-4N]
U1116  ACPL-217  [SOIC127P700X220-4N]
U1117  ACPL-217  [SOIC127P700X220-4N]

### Ports
+5.0V_VREG_0, +5.0V_VREG_1, CELL_FEEDBACK (harness CELL_FEEDBACK), FUSED_CELL (harness CELL_VOLTAGES), FUSED_VBAT-, GLOBAL-BALANCING-FEEDBACK (out)

### Harnesses
CELL_VOLTAGES: CELL_0-, CELL_0+, CELL_1+, CELL_10+, CELL_11+, CELL_12+, CELL_13+, CELL_14+, CELL_15+, CELL_16+, CELL_17+, CELL_2+, CELL_3+, CELL_4+, CELL_5+, CELL_6+, CELL_7+, CELL_8+, CELL_9+
CELL_FEEDBACK: CELL11_FEEDBACK+, CELL10_FEEDBACK+, CELL9_FEEDBACK+, CELL8_FEEDBACK+, CELL7_FEEDBACK+, CELL6_FEEDBACK+, CELL5_FEEDBACK+, CELL4_FEEDBACK+, CELL3_FEEDBACK+, CELL2_FEEDBACK+, CELL1_FEEDBACK+, CELL0_FEEDBACK+, CELL12_FEEDBACK+, CELL13_FEEDBACK+, CELL14_FEEDBACK+, CELL15_FEEDBACK+, CELL16_FEEDBACK+, CELL17_FEEDBACK+

### Nets
+5.0V_VREG_0: D1100.2(A) ; port +5.0V_VREG_0  [project net +5.0V_VREG]
+5.0V_VREG_1: D1100.1(A) ; port +5.0V_VREG_1  [project net +5.0V_VREG]
FUSED_VBAT-: C1100.1 R1118.2 ; port FUSED_VBAT-
CELL0_FEEDBACK+: R1105.1 ; port CELL_FEEDBACK.CELL0_FEEDBACK+  [project net CELL_FEEDBACK.CELL0_FEEDBACK+]
CELL1_FEEDBACK+: R1104.1 ; port CELL_FEEDBACK.CELL1_FEEDBACK+  [project net CELL_FEEDBACK.CELL1_FEEDBACK+]
CELL2_FEEDBACK+: R1103.1 ; port CELL_FEEDBACK.CELL2_FEEDBACK+  [project net CELL_FEEDBACK.CELL2_FEEDBACK+]
CELL3_FEEDBACK+: R1102.1 ; port CELL_FEEDBACK.CELL3_FEEDBACK+  [project net CELL_FEEDBACK.CELL3_FEEDBACK+]
CELL4_FEEDBACK+: R1101.1 ; port CELL_FEEDBACK.CELL4_FEEDBACK+  [project net CELL_FEEDBACK.CELL4_FEEDBACK+]
CELL5_FEEDBACK+: R1100.1 ; port CELL_FEEDBACK.CELL5_FEEDBACK+  [project net CELL_FEEDBACK.CELL5_FEEDBACK+]
CELL6_FEEDBACK+: R1111.1 ; port CELL_FEEDBACK.CELL6_FEEDBACK+  [project net CELL_FEEDBACK.CELL6_FEEDBACK+]
CELL7_FEEDBACK+: R1110.1 ; port CELL_FEEDBACK.CELL7_FEEDBACK+  [project net CELL_FEEDBACK.CELL7_FEEDBACK+]
CELL8_FEEDBACK+: R1109.1 ; port CELL_FEEDBACK.CELL8_FEEDBACK+  [project net CELL_FEEDBACK.CELL8_FEEDBACK+]
CELL9_FEEDBACK+: R1108.1 ; port CELL_FEEDBACK.CELL9_FEEDBACK+  [project net CELL_FEEDBACK.CELL9_FEEDBACK+]
CELL10_FEEDBACK+: R1107.1 ; port CELL_FEEDBACK.CELL10_FEEDBACK+  [project net CELL_FEEDBACK.CELL10_FEEDBACK+]
CELL11_FEEDBACK+: R1106.1 ; port CELL_FEEDBACK.CELL11_FEEDBACK+  [project net CELL_FEEDBACK.CELL11_FEEDBACK+]
CELL12_FEEDBACK+: R1117.1 ; port CELL_FEEDBACK.CELL12_FEEDBACK+  [project net CELL_FEEDBACK.CELL12_FEEDBACK+]
CELL13_FEEDBACK+: R1116.1 ; port CELL_FEEDBACK.CELL13_FEEDBACK+  [project net CELL_FEEDBACK.CELL13_FEEDBACK+]
CELL14_FEEDBACK+: R1115.1 ; port CELL_FEEDBACK.CELL14_FEEDBACK+  [project net CELL_FEEDBACK.CELL14_FEEDBACK+]
CELL15_FEEDBACK+: R1114.1 ; port CELL_FEEDBACK.CELL15_FEEDBACK+  [project net CELL_FEEDBACK.CELL15_FEEDBACK+]
CELL16_FEEDBACK+: R1113.1 ; port CELL_FEEDBACK.CELL16_FEEDBACK+  [project net CELL_FEEDBACK.CELL16_FEEDBACK+]
CELL17_FEEDBACK+: R1112.1 ; port CELL_FEEDBACK.CELL17_FEEDBACK+  [project net CELL_FEEDBACK.CELL17_FEEDBACK+]
FUSED_CELL_0+: U1104.2 ; port FUSED_CELL.CELL_0+  [project net FUSED_CELL.CELL_0+]
FUSED_CELL_0-: U1105.2 ; port FUSED_CELL.CELL_0-  [project net FUSED_CELL.CELL_0-]
FUSED_CELL_1+: U1103.2 ; port FUSED_CELL.CELL_1+  [project net FUSED_CELL.CELL_1+]
FUSED_CELL_2+: U1102.2 ; port FUSED_CELL.CELL_2+  [project net FUSED_CELL.CELL_2+]
FUSED_CELL_3+: U1101.2 ; port FUSED_CELL.CELL_3+  [project net FUSED_CELL.CELL_3+]
FUSED_CELL_4+: U1100.2 ; port FUSED_CELL.CELL_4+  [project net FUSED_CELL.CELL_4+]
FUSED_CELL_5+: U1111.2 ; port FUSED_CELL.CELL_5+  [project net FUSED_CELL.CELL_5+]
FUSED_CELL_6+: U1110.2 ; port FUSED_CELL.CELL_6+  [project net FUSED_CELL.CELL_6+]
FUSED_CELL_7+: U1109.2 ; port FUSED_CELL.CELL_7+  [project net FUSED_CELL.CELL_7+]
FUSED_CELL_8+: U1108.2 ; port FUSED_CELL.CELL_8+  [project net FUSED_CELL.CELL_8+]
FUSED_CELL_9+: U1107.2 ; port FUSED_CELL.CELL_9+  [project net FUSED_CELL.CELL_9+]
FUSED_CELL_10+: U1106.2 ; port FUSED_CELL.CELL_10+  [project net FUSED_CELL.CELL_10+]
FUSED_CELL_11+: U1117.2 ; port FUSED_CELL.CELL_11+  [project net FUSED_CELL.CELL_11+]
FUSED_CELL_12+: U1116.2 ; port FUSED_CELL.CELL_12+  [project net FUSED_CELL.CELL_12+]
FUSED_CELL_13+: U1115.2 ; port FUSED_CELL.CELL_13+  [project net FUSED_CELL.CELL_13+]
FUSED_CELL_14+: U1114.2 ; port FUSED_CELL.CELL_14+  [project net FUSED_CELL.CELL_14+]
FUSED_CELL_15+: U1113.2 ; port FUSED_CELL.CELL_15+  [project net FUSED_CELL.CELL_15+]
FUSED_CELL_16+: U1112.2 ; port FUSED_CELL.CELL_16+  [project net FUSED_CELL.CELL_16+]
GLOBAL-BALANCING-FEEDBACK: C1100.2 R1118.1 U1100.3 U1101.3 U1102.3 U1103.3 U1104.3 U1105.3 U1106.3 U1107.3 U1108.3 U1109.3 U1110.3 U1111.3 U1112.3 U1113.3 U1114.3 U1115.3 U1116.3 U1117.3 ; port GLOBAL-BALANCING-FEEDBACK  [project net GLOBAL-BAL-FB]
NetD1100_3: D1100.3(K) U1100.4 U1101.4 U1102.4 U1103.4 U1104.4 U1105.4 U1106.4 U1107.4 U1108.4 U1109.4 U1110.4 U1111.4 U1112.4 U1113.4 U1114.4 U1115.4 U1116.4 U1117.4
NetR1100_2: R1100.2 U1100.1
NetR1101_2: R1101.2 U1101.1
NetR1102_2: R1102.2 U1102.1
NetR1103_2: R1103.2 U1103.1
NetR1104_2: R1104.2 U1104.1
NetR1105_2: R1105.2 U1105.1
NetR1106_2: R1106.2 U1106.1
NetR1107_2: R1107.2 U1107.1
NetR1108_2: R1108.2 U1108.1
NetR1109_2: R1109.2 U1109.1
NetR1110_2: R1110.2 U1110.1
NetR1111_2: R1111.2 U1111.1
NetR1112_2: R1112.2 U1112.1
NetR1113_2: R1113.2 U1113.1
NetR1114_2: R1114.2 U1114.1
NetR1115_2: R1115.2 U1115.1
NetR1116_2: R1116.2 U1116.1
NetR1117_2: R1117.2 U1117.1

### Notes on the sheet
- (near D1100) 2.0mA  @ 1.5V
  16.0mA @ 3.6V
  26.0mA @ 5.0V
- Replace optocouplers with AEC-Q101 qualified Toshiba TLX9291A for automotive applications.
- Fraunhofer IISB
- Schottkystr. 10
- developed by:
- 91058 Erlangen
- Germany
- Author
- Project
- License
- Description
- File
- Version
- Release Date
- Sheet
- www.foxbms.org
- www.iisb.fraunhofer.de
- foxBMS Team
- /

### Library data of the parts
C1100 = gen_C_ceramic_100n_50V_X7R_0603: MLCC; Capacitance: 100n; Rated Voltage: 50V; Dielectric: X7R; Case EIA: 0603; Case Metric: 1608; PnP Package: C_0603_10; PnP Value: 100n/50V/X7R; PnP equipped: x; Automotive Qualified: True; Part Number: gen_C_ceramic_100n_50V_X7R_0603; Supplier 1: Farnell; Supplier Part Number 1: 2525267; Supplier 2: Digikey; Supplier Part Number 2: 490-6049-1-ND; Supplier 3: Farnell; Supplier Part Number 3: 2070398
D1100 = CMP-2000-04915-1: Schottky Barrier Diode, 30 V, 3-Pin SOT23, RoHS, Tape and Reel; Manufacturer: NXP Semiconductors; Forward Surge Current Ifsm Max: 600mA; Pin Configuration: 1A1,2A2,3comK; Package Version: Feb-16; Forward Voltage VF Max: 800mV; SMD Marking: L43/*W1; Diode Case Style: SOT-23; Reverse Recovery Time trr Typ: 5ns; Forward Current If(AV): 200mA; Reel Quantity: 3000; SVHC: NoSVHC(19-Dec-2012); No. of Pins: 3; Junction Temperature Tj Max: 125degC; Common Connection: Cathode; Repetitive Reverse Voltage Vrrm Max: 30V; Operating Temperature Max: 150degC; Operating Temperature Range: -65degCto+150degC; Termination Type: SMD; Package Description: 3-Pin Small Outline Transistor, Body 1.3 x 2.9 mm, Pitch 0.95 mm; Package / Case: SOT-23; Diode Type: Schottky; Manufacturer URL: http://www.nxp.com/; Tape Width: 8mm; Package Reference: SOT23-3; Datasheet URL: https://datasheet.ciiva.com/33723/1668625-33723936.pdf; Datasheet Version: Rev. 5 , 10/2012; Operating Temperature Min: -65degC; Current Ifsm: 600mA; Reverse Recovery Time trr Max: 5ns; Package URL: http://www.nxp.com/documents/outline_drawing/SOT23.pdf; Forward Voltage: 800mV
R1100-R1117 = gen_R_150R_0603: SMD Resistor 150R 0603; Tolerance: 1%; Power: 0.1W; Case EIA: 0603; Case Metric: 1608; Maximum Working Voltage: 75V; PnP Package: R_0603; Automotive Qualified: True; Part Number: gen_R_150R_0603; Operating Temperature: -55°C - +155°C; Resistance: 150R; Series: E24, E96; PnP Value: 150R; Supplier 1: Farnell; Supplier Part Number 1: 2303076
R1118 = gen_R_10k_0603: SMD Resistor 10k 0603; Tolerance: 1%; Power: 0.1W; Case EIA: 0603; Case Metric: 1608; Maximum Working Voltage: 75V; PnP Package: R_0603; Automotive Qualified: True; Part Number: gen_R_10k_0603; Operating Temperature: -55°C - +155°C; Resistance: 10k; Series: E24, E96; PnP Value: 10k; Supplier 1: Farnell; Supplier Part Number 1: 2073349
U1100-U1117 = ACPL-217-56BE: Optocoupler, Transistor Output, 1 Channel; Manufacturer: Broadcom Limited; Automotive Qualified: False; Part Number: ACPL-217-56BE; Part Name: ACPL-217; Operating Temperature: -55°C - +110°C; ComponentLink1Description: Datenblatt; ComponentLink1URL: http://www.farnell.com/datasheets/45634.pdf; Supplier 1: Farnell; Supplier Part Number 1: 1602623

## Sheet LTC.SchDoc: foxBMS BMS-Slave 12-Cell
size A3; DocumentNumber: 2; SheetNumber: 2; SheetTotal: 15; AUTHOR: Fraunhofer IISB foxBMS Team; SheetDescription: Primary LTC6813
Used 2 times, as channels U_primary_LTC, U_secondary_LTC. Parts and nets are listed once, with the designators drawn on the sheet.
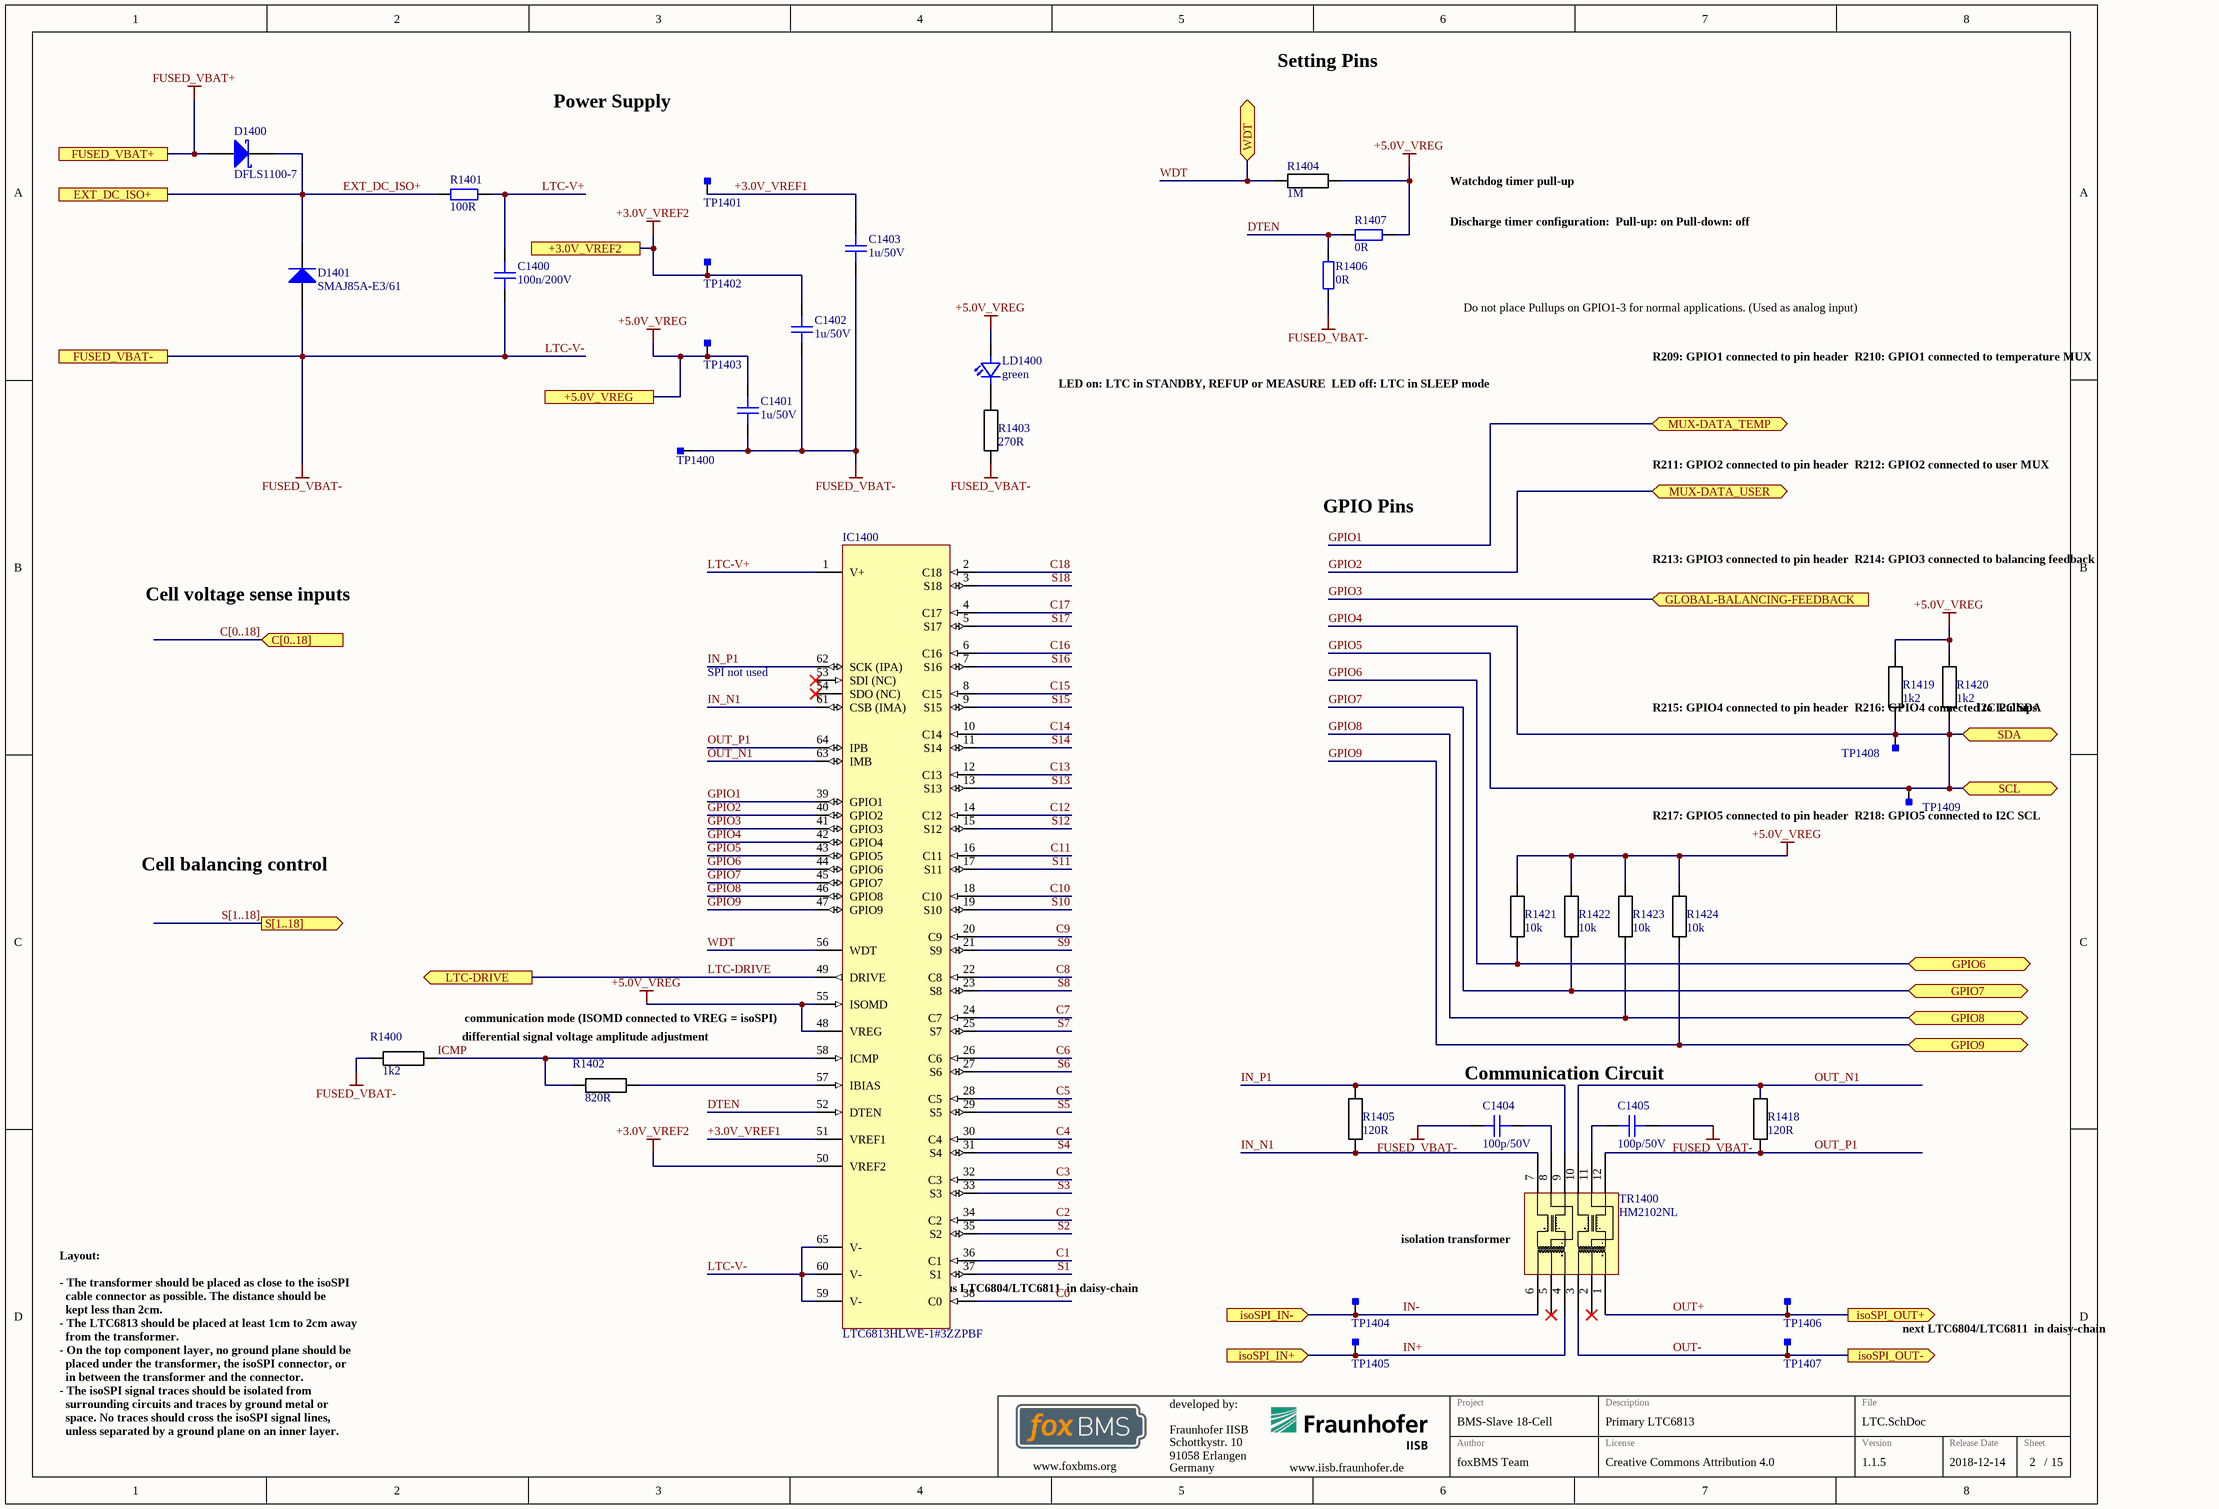
[diagram p4: LTC.SchDoc]

### Parts
C1400  100n/200V  [CAPC3216X18N]
C1401  1u/50V  [CAPC2012X14N]
C1402  1u/50V  [CAPC2012X14N]
C1403  1u/50V  [CAPC2012X14N]
C1404  100p/50V  [CAPC1608X08N]
C1405  100p/50V  [CAPC1608X08N]
D1400  DFLS1100-7  [DIOD-POWERDI123-2_V]
D1401  SMAJ85A-E3/61  [VISH-DO-214AC-2_L]
IC1400  LTC6813HLWE-1#3ZZPBF  [TSQFP50P1200X1200X160_HS-65N]
LD1400  green  [LEDC1608X07N]
R1400  1k2  [RESISTOR 1005 REFLOW]
R1401  100R  [RESC2012X05N]
R1402  820R  [RESISTOR 1005 REFLOW]
R1403  270R  [RESISTOR 0603 REFLOW]
R1404  1M  [RESISTOR 0603 REFLOW]
R1405  120R  [RESISTOR 0603 REFLOW]
R1406  0R  [RESC1608X05N]
R1407  0R  [RESC1608X05N]
R1418  120R  [RESISTOR 0603 REFLOW]
R1419  1k2  [RESISTOR 0603 REFLOW]
R1420  1k2  [RESISTOR 0603 REFLOW]
R1421  10k  [RESISTOR 0603 REFLOW]
R1422  10k  [RESISTOR 0603 REFLOW]
R1423  10k  [RESISTOR 0603 REFLOW]
R1424  10k  [RESISTOR 0603 REFLOW]
TP1400  Testpoint_Square  [Testpoint_S1]  (value not drawn)  (no BOM)
TP1401  Testpoint_Square  [Testpoint_S1]  (value not drawn)  (no BOM)
TP1402  Testpoint_Square  [Testpoint_S1]  (value not drawn)  (no BOM)
TP1403  Testpoint_Square  [Testpoint_S1]  (value not drawn)  (no BOM)
TP1404  Testpoint_Square  [Testpoint_S1]  (value not drawn)  (no BOM)
TP1405  Testpoint_Square  [Testpoint_S1]  (value not drawn)  (no BOM)
TP1406  Testpoint_Square  [Testpoint_S1]  (value not drawn)  (no BOM)
TP1407  Testpoint_Square  [Testpoint_S1]  (value not drawn)  (no BOM)
TP1408  Testpoint_Square  [Testpoint_S1]  (value not drawn)  (no BOM)
TP1409  Testpoint_Square  [Testpoint_S1]  (value not drawn)  (no BOM)
TR1400  HM2102NL  [HM2102NL]

### Ports
+3.0V_VREF2, +5.0V_VREG, C[0..18] (in), EXT_DC_ISO+, FUSED_VBAT+, FUSED_VBAT-, GLOBAL-BALANCING-FEEDBACK (in), GPIO6 (bidir), GPIO7 (bidir), GPIO8 (bidir), GPIO9 (bidir), isoSPI_IN+ (in), isoSPI_IN- (in), isoSPI_OUT+ (out), isoSPI_OUT- (out), LTC-DRIVE (out), MUX-DATA_TEMP (bidir), MUX-DATA_USER (bidir), S[1..18] (out), SCL (bidir), SDA (bidir), WDT (bidir)

### Nets
+3.0V_VREF2: C1402.2 IC1400.50(VREF2) TP1402.1 ; port +3.0V_VREF2
+5.0V_VREG: C1401.2 IC1400.48(VREG) IC1400.55(ISOMD) LD1400.2(A) R1404.2 R1407.2 R1419.2 R1420.2 R1421.2 R1422.2 R1423.2 R1424.2 TP1403.1 ; port +5.0V_VREG
FUSED_VBAT+: D1400.1(A) ; port FUSED_VBAT+
FUSED_VBAT-: C1400.2 C1401.1 C1402.1 C1403.1 C1404.1 C1405.1 D1401.2(A) IC1400.59(V-) IC1400.60(V-) IC1400.65(V-) R1400.1 R1403.1 R1406.1 TP1400.1 ; port FUSED_VBAT-  [also labelled LTC-V-]
+3.0V_VREF1: C1403.2 IC1400.51(VREF1) TP1401.1
C0: IC1400.38(C0)
C1: IC1400.36(C1)
C2: IC1400.34(C2)
C3: IC1400.32(C3)
C4: IC1400.30(C4)
C5: IC1400.28(C5)
C6: IC1400.26(C6)
C7: IC1400.24(C7)
C8: IC1400.22(C8)
C9: IC1400.20(C9)
C10: IC1400.18(C10)
C11: IC1400.16(C11)
C12: IC1400.14(C12)
C13: IC1400.12(C13)
C14: IC1400.10(C14)
C15: IC1400.8(C15)
C16: IC1400.6(C16)
C17: IC1400.4(C17)
C18: IC1400.2(C18)
DTEN: IC1400.52(DTEN) R1406.2 R1407.1
EXT_DC_ISO+: D1400.2(K) D1401.1(K) R1401.1 ; port EXT_DC_ISO+
GPIO1: IC1400.39(GPIO1) ; port MUX-DATA_TEMP
GPIO2: IC1400.40(GPIO2) ; port MUX-DATA_USER
GPIO3: IC1400.41(GPIO3) ; port GLOBAL-BALANCING-FEEDBACK
GPIO4: IC1400.42(GPIO4) IC1400.43(GPIO5) R1419.1 R1420.1 TP1408.1 TP1409.1 ; port SCL, port SDA  [also labelled GPIO5]
GPIO6: IC1400.44(GPIO6) R1421.1 ; port GPIO6
GPIO7: IC1400.45(GPIO7) R1422.1 ; port GPIO7
GPIO8: IC1400.46(GPIO8) R1423.1 ; port GPIO8
GPIO9: IC1400.47(GPIO9) R1424.1 ; port GPIO9
ICMP: IC1400.58(ICMP) R1400.2 R1402.1
IN+: TP1405.1 TR1400.4 ; port isoSPI_IN+
IN-: TP1404.1 TR1400.6 ; port isoSPI_IN-
IN_N1: IC1400.61(CSB_(IMA)) R1405.1 TR1400.7
IN_P1: IC1400.62(SCK_(IPA)) R1405.2 TR1400.9
LTC-DRIVE: IC1400.49(DRIVE) ; port LTC-DRIVE
LTC-V+: C1400.1 IC1400.1(V+) R1401.2
OUT+: TP1406.1 TR1400.1 ; port isoSPI_OUT+
OUT-: TP1407.1 TR1400.3 ; port isoSPI_OUT-
OUT_N1: IC1400.63(IMB) R1418.2 TR1400.10
OUT_P1: IC1400.64(IPB) R1418.1 TR1400.12
S1: IC1400.37(S1)
S2: IC1400.35(S2)
S3: IC1400.33(S3)
S4: IC1400.31(S4)
S5: IC1400.29(S5)
S6: IC1400.27(S6)
S7: IC1400.25(S7)
S8: IC1400.23(S8)
S9: IC1400.21(S9)
S10: IC1400.19(S10)
S11: IC1400.17(S11)
S12: IC1400.15(S12)
S13: IC1400.13(S13)
S14: IC1400.11(S14)
S15: IC1400.9(S15)
S16: IC1400.7(S16)
S17: IC1400.5(S17)
S18: IC1400.3(S18)
WDT: IC1400.56(WDT) R1404.1 ; port WDT
NetC1404_2: C1404.2 TR1400.8
NetC1405_2: C1405.2 TR1400.11
NetIC1400_57: IC1400.57(IBIAS) R1402.2
NetLD1400_1: LD1400.1(C) R1403.2

Not connected (* = marked no-connect by the designer): IC1400 53(SDI_(NC))* 54(SDO_(NC))*; TR1400 2* 5*

### Channels
U_primary_LTC: designators end in _1; ports +3.0V_VREF2=+3.0V_VREF2 +5.0V_VREG=+5.0V_VREG EXT_DC_ISO+=EXT_DC_ISO+ FUSED_VBAT+=FUSED_VBAT+ FUSED_VBAT-=FUSED_VBAT- GLOBAL-BALANCING-FEEDBACK=GLOBAL-BAL-FB GPIO6=GPIO6_U_primary_LTC GPIO7=GPIO7_U_primary_LTC GPIO8=GPIO8_U_primary_LTC GPIO9=GPIO9_U_primary_LTC isoSPI_IN+=PRIMARY-IN+ isoSPI_IN-=PRIMARY-IN- isoSPI_OUT+=PRIMARY-OUT+ isoSPI_OUT-=PRIMARY-OUT- LTC-DRIVE=PRIMARY-LTC-DRIVE MUX-DATA_TEMP=PRIMARY-MUX-DATA_TEMP MUX-DATA_USER=PRIMARY-MUX-DATA_USER SCL=PRIMARY-SCL SDA=PRIMARY-SCL WDT=WDT_U_primary_LTC
U_secondary_LTC: designators end in _2; ports +3.0V_VREF2=+3.0V_VREF2 +5.0V_VREG=+5.0V_VREG EXT_DC_ISO+=EXT_DC_ISO+ FUSED_VBAT+=FUSED_VBAT+ FUSED_VBAT-=FUSED_VBAT- GLOBAL-BALANCING-FEEDBACK=GLOBAL-BAL-FB GPIO6=GPIO6_U_secondary_LTC GPIO7=GPIO7_U_secondary_LTC GPIO8=GPIO8_U_secondary_LTC GPIO9=GPIO9_U_secondary_LTC isoSPI_IN+=SECONDARY-IN+ isoSPI_IN-=SECONDARY-IN- isoSPI_OUT+=SECONDARY-OUT+ isoSPI_OUT-=SECONDARY-OUT- LTC-DRIVE=SECONDARY-LTC-DRIVE MUX-DATA_TEMP=SECONDARY-MUX-DATA_TEMP MUX-DATA_USER=SECONDARY-MUX-DATA_USER SCL=SECONDARY-SCL SDA=SECONDARY-SCL WDT=WDT_U_secondary_LTC

### Buses and harness runs
bus C[0..18] = port C[0..18]
bus S[1..18] = port S[1..18]

### Notes on the sheet
- Power Supply
- Setting Pins
- Watchdog timer pull-up
- Discharge timer configuration:
  Pull-up: on
  Pull-down: off
- Do not place Pullups on GPIO1-3 for normal applications. (Used as analog input)
- LED on: LTC in STANDBY, REFUP or MEASURE
  LED off: LTC in SLEEP mode
- R209: GPIO1 connected to pin header
  R210: GPIO1 connected to temperature MUX
- GPIO Pins
- R211: GPIO2 connected to pin header
  R212: GPIO2 connected to user MUX
- R213: GPIO3 connected to pin header
  R214: GPIO3 connected to balancing feedback
- Cell voltage sense inputs
- SPI not used
- R215: GPIO4 connected to pin header
  R216: GPIO4 connected to I2C SDA
- (near R1420) I2C Pullups
- (near TP1409) R217: GPIO5 connected to pin header
  R218: GPIO5 connected to I2C SCL
- Cell balancing control
- communication mode (ISOMD connected to VREG = isoSPI)
- (near R1400) differential signal voltage amplitude adjustment
- Communication Circuit
- (near TR1400) isolation transformer
- (near TP1404) previous LTC6804/LTC6811
  in daisy-chain
- next LTC6804/LTC6811
  in daisy-chain
- Layout:
  - The transformer should be placed as close to the isoSPI
  cable connector as possible. The distance should be
  kept less than 2cm.
  - The LTC6813 should be placed at least 1cm to 2cm away
  from the transformer.
  - On the top component layer, no ground plane should be
  placed under the transformer, the isoSPI connector, or
  in between the transformer and the connector.
  - The isoSPI signal traces should be isolated from
  surrounding circuits and traces by ground metal or
  space. No traces should cross the isoSPI signal lines,
  unless separated by a ground plane on an inner layer.
- Fraunhofer IISB
- Schottkystr. 10
- developed by:
- 91058 Erlangen
- Germany
- Author
- Project
- License
- Description
- File
- Version
- Release Date
- Sheet
- www.foxbms.org
- www.iisb.fraunhofer.de
- foxBMS Team
- /

### Library data of the parts
C1400 = gen_C_ceramic_100n_200V_X7R_1206: MLCC; Capacitance: 100n; Rated Voltage: 200V; Dielectric: X7R; Case EIA: 1206; Case Metric: 3216; Automotive Qualified: True; Part Number: gen_C_ceramic_100n_200V_X7R_1206; Supplier 1: Farnell; Supplier Part Number 1: 2673161; Supplier 2: Farnell; Supplier Part Number 2: 2520773
C1401-C1403 = gen_C_ceramic_1u_50V_X7R_0805: MLCC; Capacitance: 1u; Rated Voltage: 50V; Dielectric: X7R; Case EIA: 0805; Case Metric: 2012; Automotive Qualified: True; Tolerance: ± 10%; AVT Set: x; Part Number: gen_C_ceramic_1u_50V_X7R_0805; Supplier 1: Farnell; Supplier Part Number 1: 2672199; Operating Temperature: -55°C - +125°C; Supplier 2: Farnell; Supplier Part Number 2: 2479894; Supplier 3: Farnell; Supplier Part Number 3: 2464630
C1404 C1405 = gen_C_ceramic_100p_50V_C0G_0603: MLCC; Capacitance: 100p; Rated Voltage: 50V; Dielectric: C0G; Case EIA: 0603; Case Metric: 1608; Automotive Qualified: True; Tolerance: ± 10%; Part Number: gen_C_ceramic_100p_50V_C0G_0603; Supplier 1: Farnell; Supplier Part Number 1: 2478236
D1400 = CMP-2000-05099-1: 1 A High Voltage Schottky Barrier Rectifier, 0.62 V, -55 to 175 degC, 2- Pin POWERDI123, Pb-Free, Tape and Reel; Manufacturer: Diodes Inc; Average Rectified Current-Max: 1A; Peak Current-Max: 40A; Forward Voltage: 0.77V; Reverse Current-Max: 1µA; Reverse Voltage-Max [Vrrm]: 100V; Datasheet Version: Sep-14; Datasheet URL: https://datasheet.ciiva.com/15144/getdatasheetpartid-44146-15144126.pdf; Manufacturer URL: http://www.diodes.com/
D1401 = CMP-0548-00243-2: Transient Voltage Suppressor, 6.40 to 231 V, 85 V Stand-off Voltage, Uni-Directional, -55 to 155 degC, 2-pin DO-214AC, Pb-Free, Tape and Reel; Manufacturer: Vishay Semiconductor; VWM (V): 85; PPPM (W): 400, 300; VBR Uni-Directional (V): 6.4 to 231; IFSM: 40 A; ID (uA): 1; RoHS: TRUE; ComponentLink3Description: Package Specification; PackageReference: DO-214AC-2; PartNumber: SMAJ85A-E3/61; ComponentLink2Description: Datasheet; ComponentLink2URL: http://www.vishay.com/docs/88390/smaj50a.pdf; ComponentLink3URL: http://www.vishay.com/docs/88390/smaj50a.pdf; Packing: Tape and Reel; ComponentLink1Description: Manufacturer URL; PackageDescription: 2-Pin DO-214AC (SMA), Body 4.245 x 2.665 mm; DatasheetVersion: 12/8/2013; ComponentLink1URL: http://www.vishay.com/; Operating Junction and Storage Temperature Range: -55 to 150 degC; Mounting Technology: Surface Mount
IC1400 = LTC6813HLWE-1#3ZZPBF: 18 Cell Multicell Battery Monitor, -40 to 125 degC, Pb-Free; PartNumber: LTC6811HG-1#PBF; Manufacturer: Linear Technology; Type of Charger: Battery Stack Monitor; Vin Max(V): 60; Battery Chemistry: Li-Ion, Li-Polymer, NiMH; Number of Cells: > 1000 V of stacked Li-Ion cells; Automotive Qualified: True; PnP Package: QFP-64; RoHS: TRUE; ComponentLink1Description: Datasheet; ComponentLink1URL: http://www.linear.com/docs/59387; PackageReference: G-48; PackageVersion: Rev. Ã˜, 01/2011; ComponentLink2Description: Datasheet; Mounting Technology: Surface Mount; ComponentLink3Description: Package Specification; PackageDescription: 48-Pin Plastic SSOP, Body 12.8 x 5.3 mm, Pitch 0.5 mm; ComponentLink3URL: http://cds.linear.com/docs/en/packaging/05081887_0_G48.pdf; ComponentLink2URL: http://cds.linear.com/docs/en/datasheet/680412f.pdf; Part Number: LTC6813HLWE-1#3ZZPBF; Part Name: LTC6813HLWE-1#3ZZPBF; Operating Temperature: -40°C - +125°C; Supplier 1: Digikey; Supplier Part Number 1: LTC6813HLWE-1#3ZZPBF-ND
LD1400 = LED_0603_green_AECQ: TLMG1100-GS08; Manufacturer: Vishay; Breakdown Voltage: 5V; Continuous Forward Current: 20mA; Forward Voltage @ 20mA: 2.1V; Automotive Qualified: True; Part Number: LED_0603_green_AECQ; Color: green; Supplier 1: Farnell; Supplier Part Number 1: 2293494; PnP Package: LED_0603; Operating Temperature: -40°C - 100°C; ComponentLink1Description: Datasheet; ComponentLink1URL: http://www.farnell.com/datasheets/2049164.pdf; Supplier 2: Digikey; Supplier Part Number 2: 751-1165-1-ND
R1400 R1419 R1420 = Resistor: Resistor 0603 1k2 0.1W; Value: 1k2
R1401 = gen_R_100R_0805: SMD Resistor 100R 0805; Tolerance: 1%; Power: 0.125W; Case EIA: 0805; Case Metric: 2012; Maximum Working Voltage: 150V; PnP Package: R_0805; Automotive Qualified: True; Part Number: gen_R_100R_0805; Operating Temperature: -55°C - +155°C; Resistance: 100R; Series: E24, E96; PnP Value: 100R; Supplier 1: Farnell; Supplier Part Number 1: 1469862
R1402 = Resistor: Resistor 0603 820R 0.1W; Value: 820R
R1403 = Resistor: Resistor 0603 270R 0.1W; Value: 270R
R1404 = Resistor: Resistor 0603 1M 0.1W; Value: 1M
R1405 R1418 = Resistor: Resistor 0603 120R 0.1W; Value: 120R
R1406 R1407 = gen_R_0R_0603: as SJ300 on sheet cell_fuses; Part Number: gen_R_0R_0603; Operating Temperature: -55°C - +155°C; Resistance: 0R; Series: Jumper; PnP Value: 0R; Supplier 1: Farnell; Supplier Part Number 1: 2616580
R1421-R1424 = Resistor: Resistor 0603 10k 0.1W; Value: 10k
TP1400-TP1409 = Testpoint_Square: Testpoint, square; Part Number: Testpoint_Square
TR1400 = HM2102NL: Pulse HM2102NL BMS Transformer; Automotive Qualified: True; Part Number: HM2102NL; Manufacturer: Pulse; Operating Temperature: -40°C - +125°C; ComponentLink1Description: Datasheet; ComponentLink1URL: https://www.mouser.com/ds/2/336/HM2102NL-1218600.pdf; Supplier 1: Mouser; Supplier Part Number 1: 673-HM2102NL; Supplier 2: Digikey; Supplier Part Number 2: 1840-1034-1-ND

## Sheet eeprom_temp_sens.SchDoc: foxBMS BMS-Slave 12-Cell
size A3; DocumentNumber: 9; SheetNumber: 9; SheetTotal: 15; AUTHOR: Fraunhofer IISB foxBMS Team; SheetDescription: Primary EEPROM and Board T-Sensor
Used 2 times, as channels U_secondary_eeprom_temp_sens, U_primary_eeprom_temp_sens. Parts and nets are listed once, with the designators drawn on the sheet.
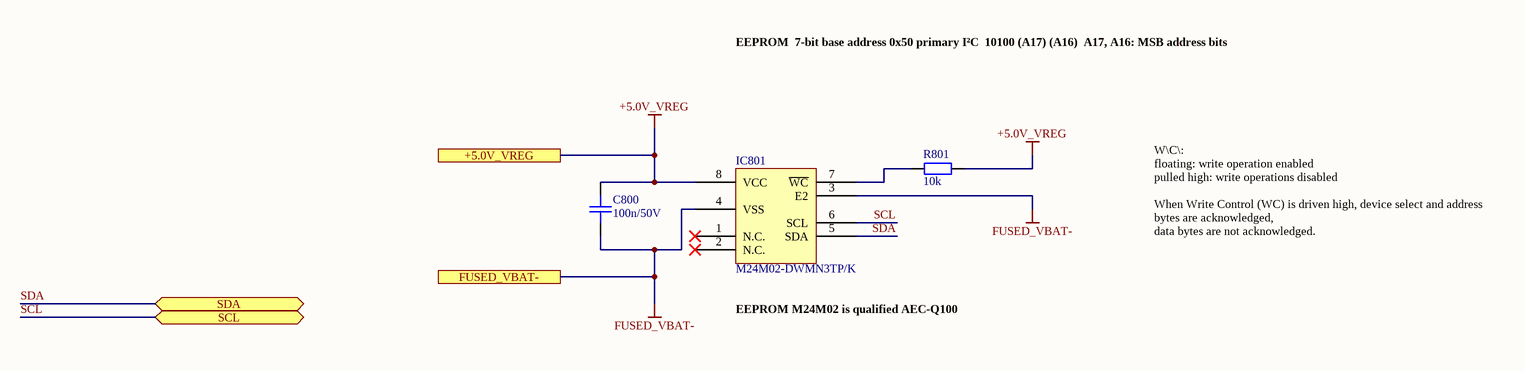
[diagram p5: eeprom_temp_sens.SchDoc]

### Parts
C800  100n/50V  [CAPC1608X08N]
IC801  M24M02-DWMN3TP/K  [SOIC127P600X175-8N]
R801  10k  [RESC1608X05N]

### Ports
+5.0V_VREG, FUSED_VBAT-, SCL (bidir), SDA (bidir)

### Nets
+5.0V_VREG: C800.2 IC801.8(VCC) R801.2 ; port +5.0V_VREG
FUSED_VBAT-: C800.1 IC801.3(E2) IC801.4(VSS) ; port FUSED_VBAT-
SCL: IC801.6(SCL) ; port SCL
SDA: IC801.5(SDA) ; port SDA
NetIC801_7: IC801.7(~{WC}) R801.1

Not connected (* = marked no-connect by the designer): IC801 1(N.C.)* 2(N.C.)*

### Channels
U_secondary_eeprom_temp_sens: designators end in _1; ports +5.0V_VREG=+5.0V_VREG FUSED_VBAT-=FUSED_VBAT- SCL=SECONDARY-SCL SDA=SECONDARY-SCL
U_primary_eeprom_temp_sens: designators end in _2; ports +5.0V_VREG=+5.0V_VREG FUSED_VBAT-=FUSED_VBAT- SCL=PRIMARY-SCL SDA=PRIMARY-SCL

### Notes on the sheet
- EEPROM
  7-bit base address 0x50 primary I²C
  10100 (A17) (A16)
  A17, A16: MSB address bits
- W\C\:
  floating: write operation enabled
  pulled high: write operations disabled
  When Write Control (WC) is driven high, device select and address bytes are acknowledged,
  data bytes are not acknowledged.
- EEPROM M24M02 is qualified AEC-Q100
- Fraunhofer IISB
- Schottkystr. 10
- developed by:
- 91058 Erlangen
- Germany
- Author
- Project
- License
- Description
- File
- Version
- Release Date
- Sheet
- www.foxbms.org
- www.iisb.fraunhofer.de
- foxBMS Team
- /

### Library data of the parts
C800 = gen_C_ceramic_100n_50V_X7R_0603: as C1100 on sheet feedback; Part Number: gen_C_ceramic_100n_50V_X7R_0603; Supplier 1: Farnell; Supplier Part Number 1: 2525267; Supplier 2: Digikey; Supplier Part Number 2: 490-6049-1-ND; Supplier 3: Farnell; Supplier Part Number 3: 2070398
IC801 = M24M02-DWMN3TP/K: Automotive 2-Mbit serial I²C / bus EEPROM with 1 MHz clock; Manufacturer: STMicroelectronics; PnP Package: SO8N; Automotive Qualified: True; Part Number: M24M02-DWMN3TP/K; Part Name: M24M02-DWMN3TP/K; Operating Temperature: -40°C - +125°C; ComponentLink1Description: Datasheet; ComponentLink1URL: http://www.st.com/content/ccc/resource/technical/document/datasheet/83/f4/3e/e4/4e/49/42/c5/DM00200595.pdf/files/DM00200595.pdf/jcr:content/translations/en.DM00200595.pdf; Supplier 1: Digikey; Supplier Part Number 1: 497-16238-1-ND; Supplier 2: Mouser; Supplier Part Number 2: 511-M24M02-DWMN3TP/K; Supplier 3: Farnell; Supplier Part Number 3: 2849971
R801 = gen_R_10k_0603: as R1118 on sheet feedback; Part Number: gen_R_10k_0603; Operating Temperature: -55°C - +155°C; Resistance: 10k; Series: E24, E96; PnP Value: 10k; Supplier 1: Farnell; Supplier Part Number 1: 2073349